# EAGLE design TireTempSensor (EAGLE 5.12)
BOARDNAME: Tire Thermal Sensor; BOM: EXCLUDE; DATABASE: ../../../../Component libraries/partsdb.txt; PARTNO: KC5032A25.0000CM0E00; RELEASE: BETA

## Sheet 1 of 6
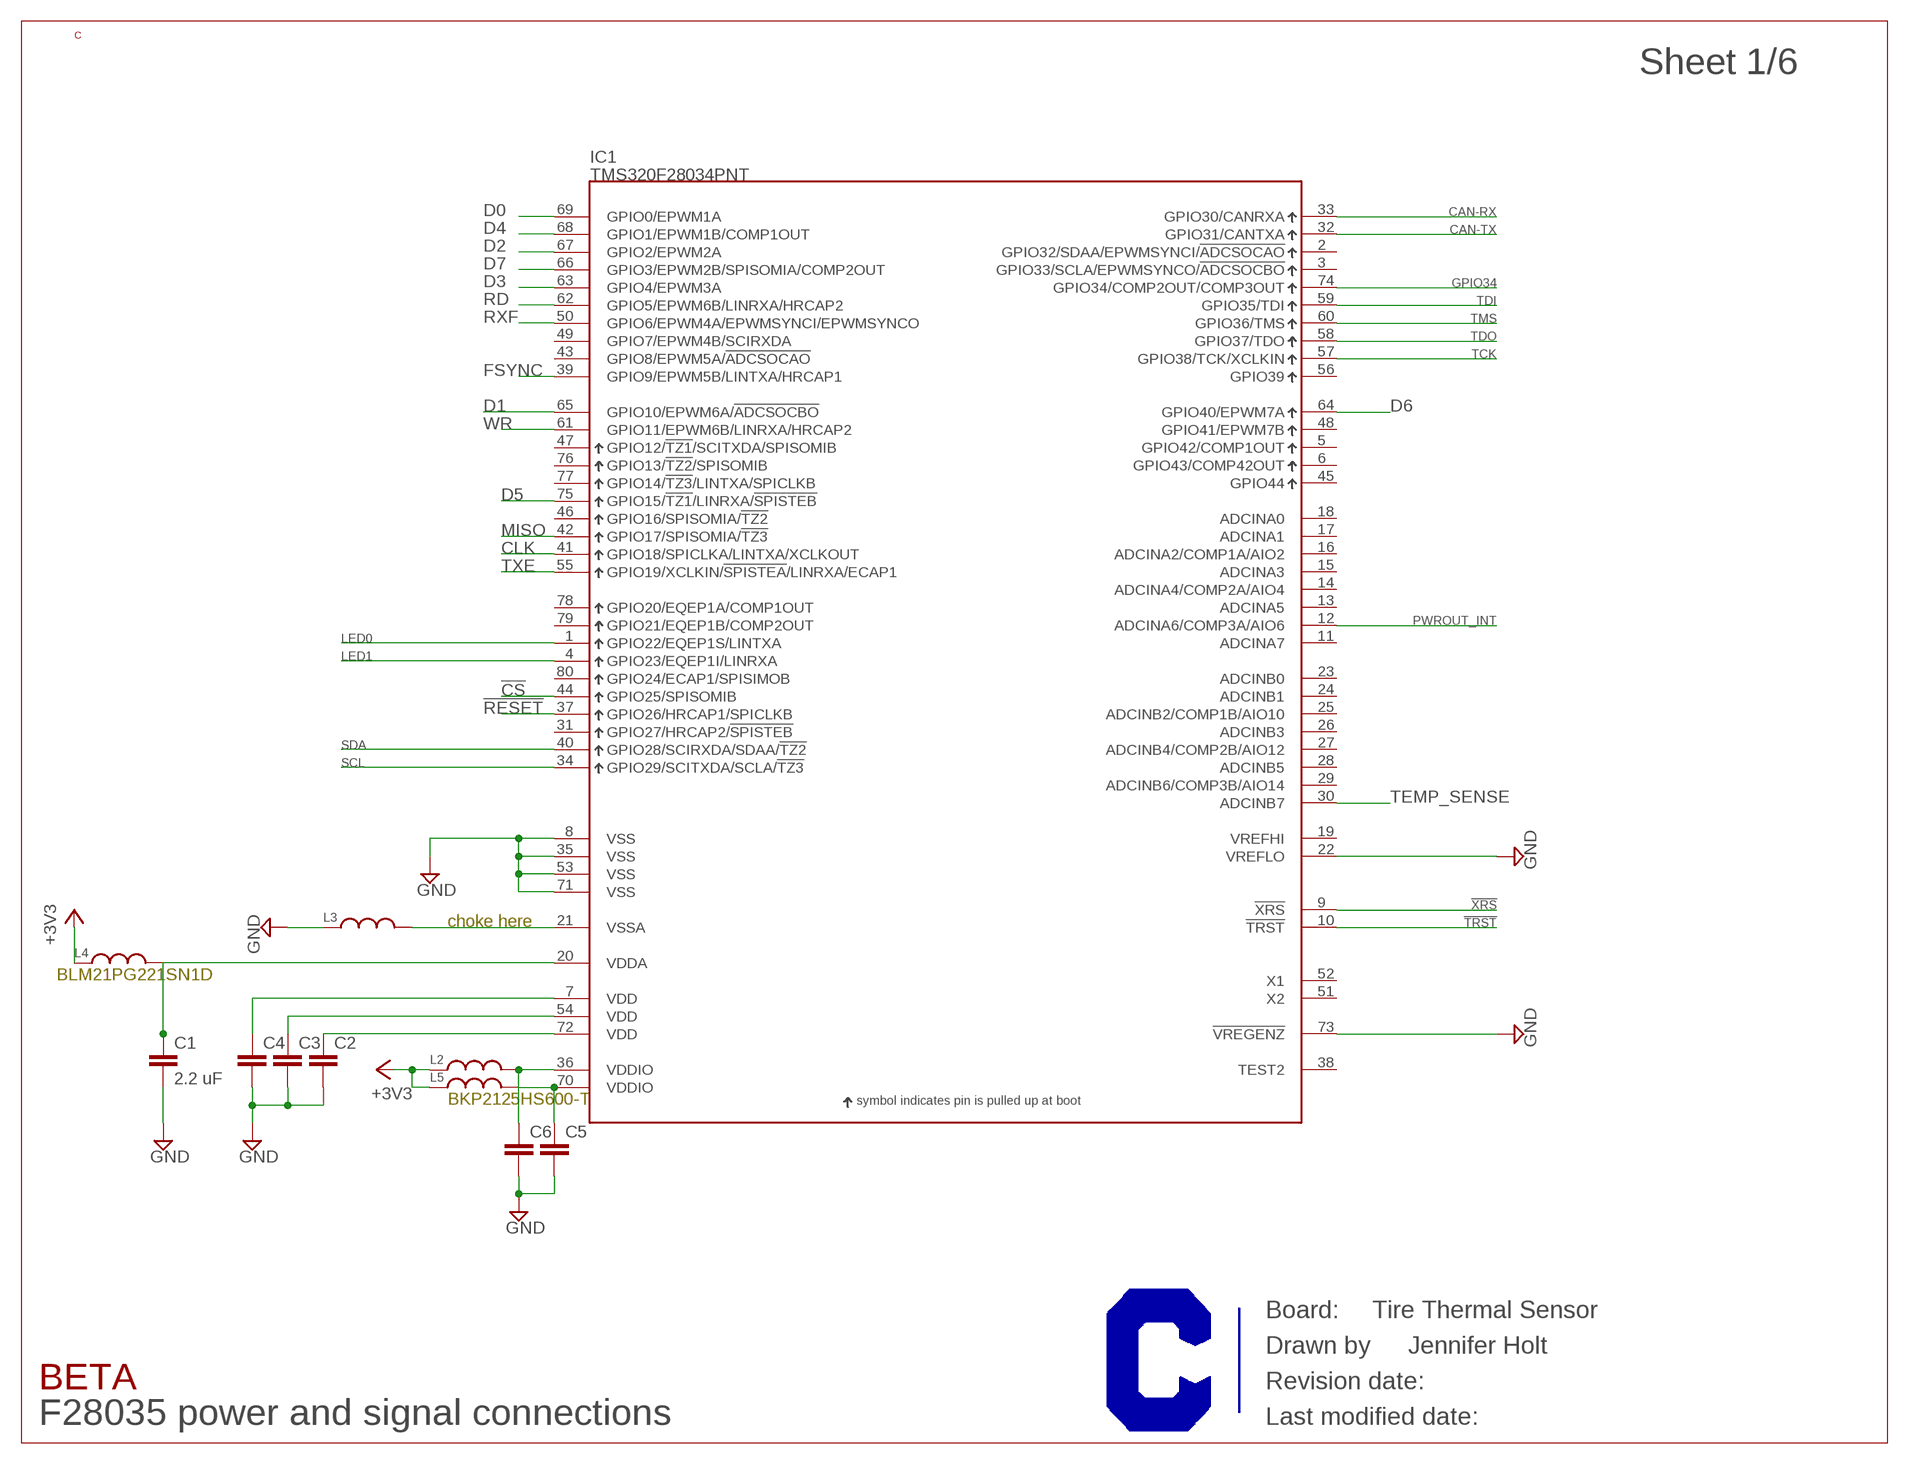
[diagram p0: schematic, sheet 1]

### Parts
C1  2.2 uF  C-EUC0603  [C0603]
C2  2.2 uF  C-EUC0603  [C0603]
C3  2.2 uF  C-EUC0603  [C0603]
C4  2.2 uF  C-EUC0603  [C0603]
C5  2.2 uF  C-EUC0603  [C0603]
C6  2.2 uF  C-EUC0603  [C0603]
IC1  TMS320F28034PNT  [PQFP-80_(S-PQFP-G80)]
L2  INDUCTOR  [0603]
L3  INDUCTOR  [0603]
L4  INDUCTOR  [0603]
L5  INDUCTOR  [0603]
U$2  CURRENT-C-LETTER-LANDSCAPE  [BLANK]
U$11  CURRENT-LOGO-0.25"  [CURRENT-0.25"]

### Nets
!CS: IC1.44(GPIO25/SPISOMIB) ; also sheet 6
!RESET: IC1.37(GPIO26/HRCAP1/SPICLKB) ; also sheet 6
!TRST: IC1.10(!TRST) ; also sheet 2
!XRS: IC1.9(!XRS)
+3V3 [power]: L2.A L4.A L5.A ; also sheet 2,3,5,6
CAN-RX: IC1.33(GPIO30/CANRXA) ; also sheet 4
CAN-TX: IC1.32(GPIO31/CANTXA) ; also sheet 4
CLK: IC1.41(GPIO18/SPICLKA/LINTXA/XCLKOUT) ; also sheet 6
D0: IC1.69(GPIO0/EPWM1A) ; also sheet 2
D1: IC1.65(GPIO10/EPWM6A/!ADCSOCBO) ; also sheet 2
D2: IC1.67(GPIO2/EPWM2A) ; also sheet 2
D3: IC1.63(GPIO4/EPWM3A) ; also sheet 2
D4: IC1.68(GPIO1/EPWM1B/COMP1OUT) ; also sheet 2
D5: IC1.75(GPIO15/!TZ1!/LINRXA/!SPISTEB) ; also sheet 2
D6: IC1.64(GPIO40/EPWM7A) ; also sheet 2
D7: IC1.66(GPIO3/EPWM2B/SPISOMIA/COMP2OUT) ; also sheet 2
FSYNC: IC1.39(GPIO9/EPWM5B/LINTXA/HRCAP1) ; also sheet 6
GND: C1.2 C2.2 C3.2 C4.2 C5.2 C6.2 IC1.8(VSS) IC1.22(VREFLO) IC1.35(VSS) IC1.53(VSS) IC1.71(VSS) IC1.73(!VREGENZ) L3.A ; also sheet 2,3,4,5,6
GPIO34: IC1.74(GPIO34/COMP2OUT/COMP3OUT) ; also sheet 2
LED0: IC1.1(GPIO22/EQEP1S/LINTXA) ; also sheet 5
LED1: IC1.4(GPIO23/EQEP1I/LINRXA) ; also sheet 5
MISO: IC1.42(GPIO17/SPISOMIA/!TZ3) ; also sheet 6
N$10: IC1.21(VSSA) L3.B
N$11: C6.1 IC1.36(VDDIO) L2.B
N$12: C5.1 IC1.70(VDDIO) L5.B
PWROUT_INT: IC1.12(ADCINA6/COMP3A/AIO6) ; also sheet 3
RD: IC1.62(GPIO5/EPWM6B/LINRXA/HRCAP2) ; also sheet 2
RXF: IC1.50(GPIO6/EPWM4A/EPWMSYNCI/EPWMSYNCO) ; also sheet 2
SCL: IC1.34(GPIO29/SCITXDA/SCLA/!TZ3) ; also sheet 6
SDA: IC1.40(GPIO28/SCIRXDA/SDAA/!TZ2) ; also sheet 6
TCK: IC1.57(GPIO38/TCK/XCLKIN) ; also sheet 2
TDI: IC1.59(GPIO35/TDI) ; also sheet 2
TDO: IC1.58(GPIO37/TDO) ; also sheet 2
TEMP_SENSE: IC1.30(ADCINB7) ; also sheet 6
TMS: IC1.60(GPIO36/TMS) ; also sheet 2
TXE: IC1.55(GPIO19/XCLKIN/!SPISTEA!/LINRXA/ECAP1) ; also sheet 2
VDD1: C2.1 IC1.72(VDD)
VDD2: C3.1 IC1.54(VDD)
VDD3: C4.1 IC1.7(VDD)
VDDA: C1.1 IC1.20(VDDA) L4.B
WR: IC1.61(GPIO11/EPWM6B/LINRXA/HRCAP2) ; also sheet 2
Unconnected: IC1.2(GPIO32/SDAA/EPWMSYNCI/!ADCSOCAO) IC1.3(GPIO33/SCLA/EPWMSYNCO/!ADCSOCBO) IC1.5(GPIO42/COMP1OUT) IC1.6(GPIO43/COMP42OUT) IC1.11(ADCINA7) IC1.13(ADCINA5) IC1.14(ADCINA4/COMP2A/AIO4) IC1.15(ADCINA3) IC1.16(ADCINA2/COMP1A/AIO2) IC1.17(ADCINA1) IC1.18(ADCINA0) IC1.19(VREFHI) IC1.23(ADCINB0) IC1.24(ADCINB1) IC1.25(ADCINB2/COMP1B/AIO10) IC1.26(ADCINB3) IC1.27(ADCINB4/COMP2B/AIO12) IC1.28(ADCINB5) IC1.29(ADCINB6/COMP3B/AIO14) IC1.31(GPIO27/HRCAP2/!SPISTEB) IC1.38(TEST2) IC1.43(GPIO8/EPWM5A/!ADCSOCAO) IC1.45(GPIO44) IC1.46(GPIO16/SPISOMIA/!TZ2) IC1.47(GPIO12/!TZ1!/SCITXDA/SPISOMIB) IC1.48(GPIO41/EPWM7B) IC1.49(GPIO7/EPWM4B/SCIRXDA) IC1.51(X2) IC1.52(X1) IC1.56(GPIO39) IC1.76(GPIO13/!TZ2!/SPISOMIB) IC1.77(GPIO14/!TZ3!/LINTXA/SPICLKB) IC1.78(GPIO20/EQEP1A/COMP1OUT) IC1.79(GPIO21/EQEP1B/COMP2OUT) IC1.80(GPIO24/ECAP1/SPISIMOB)

### Notes on the sheet
- choke here
- BLM21PG221SN1D
- BKP2125HS600-T
- Jennifer Holt
- F28035 power and signal connections

## Sheet 2 of 6
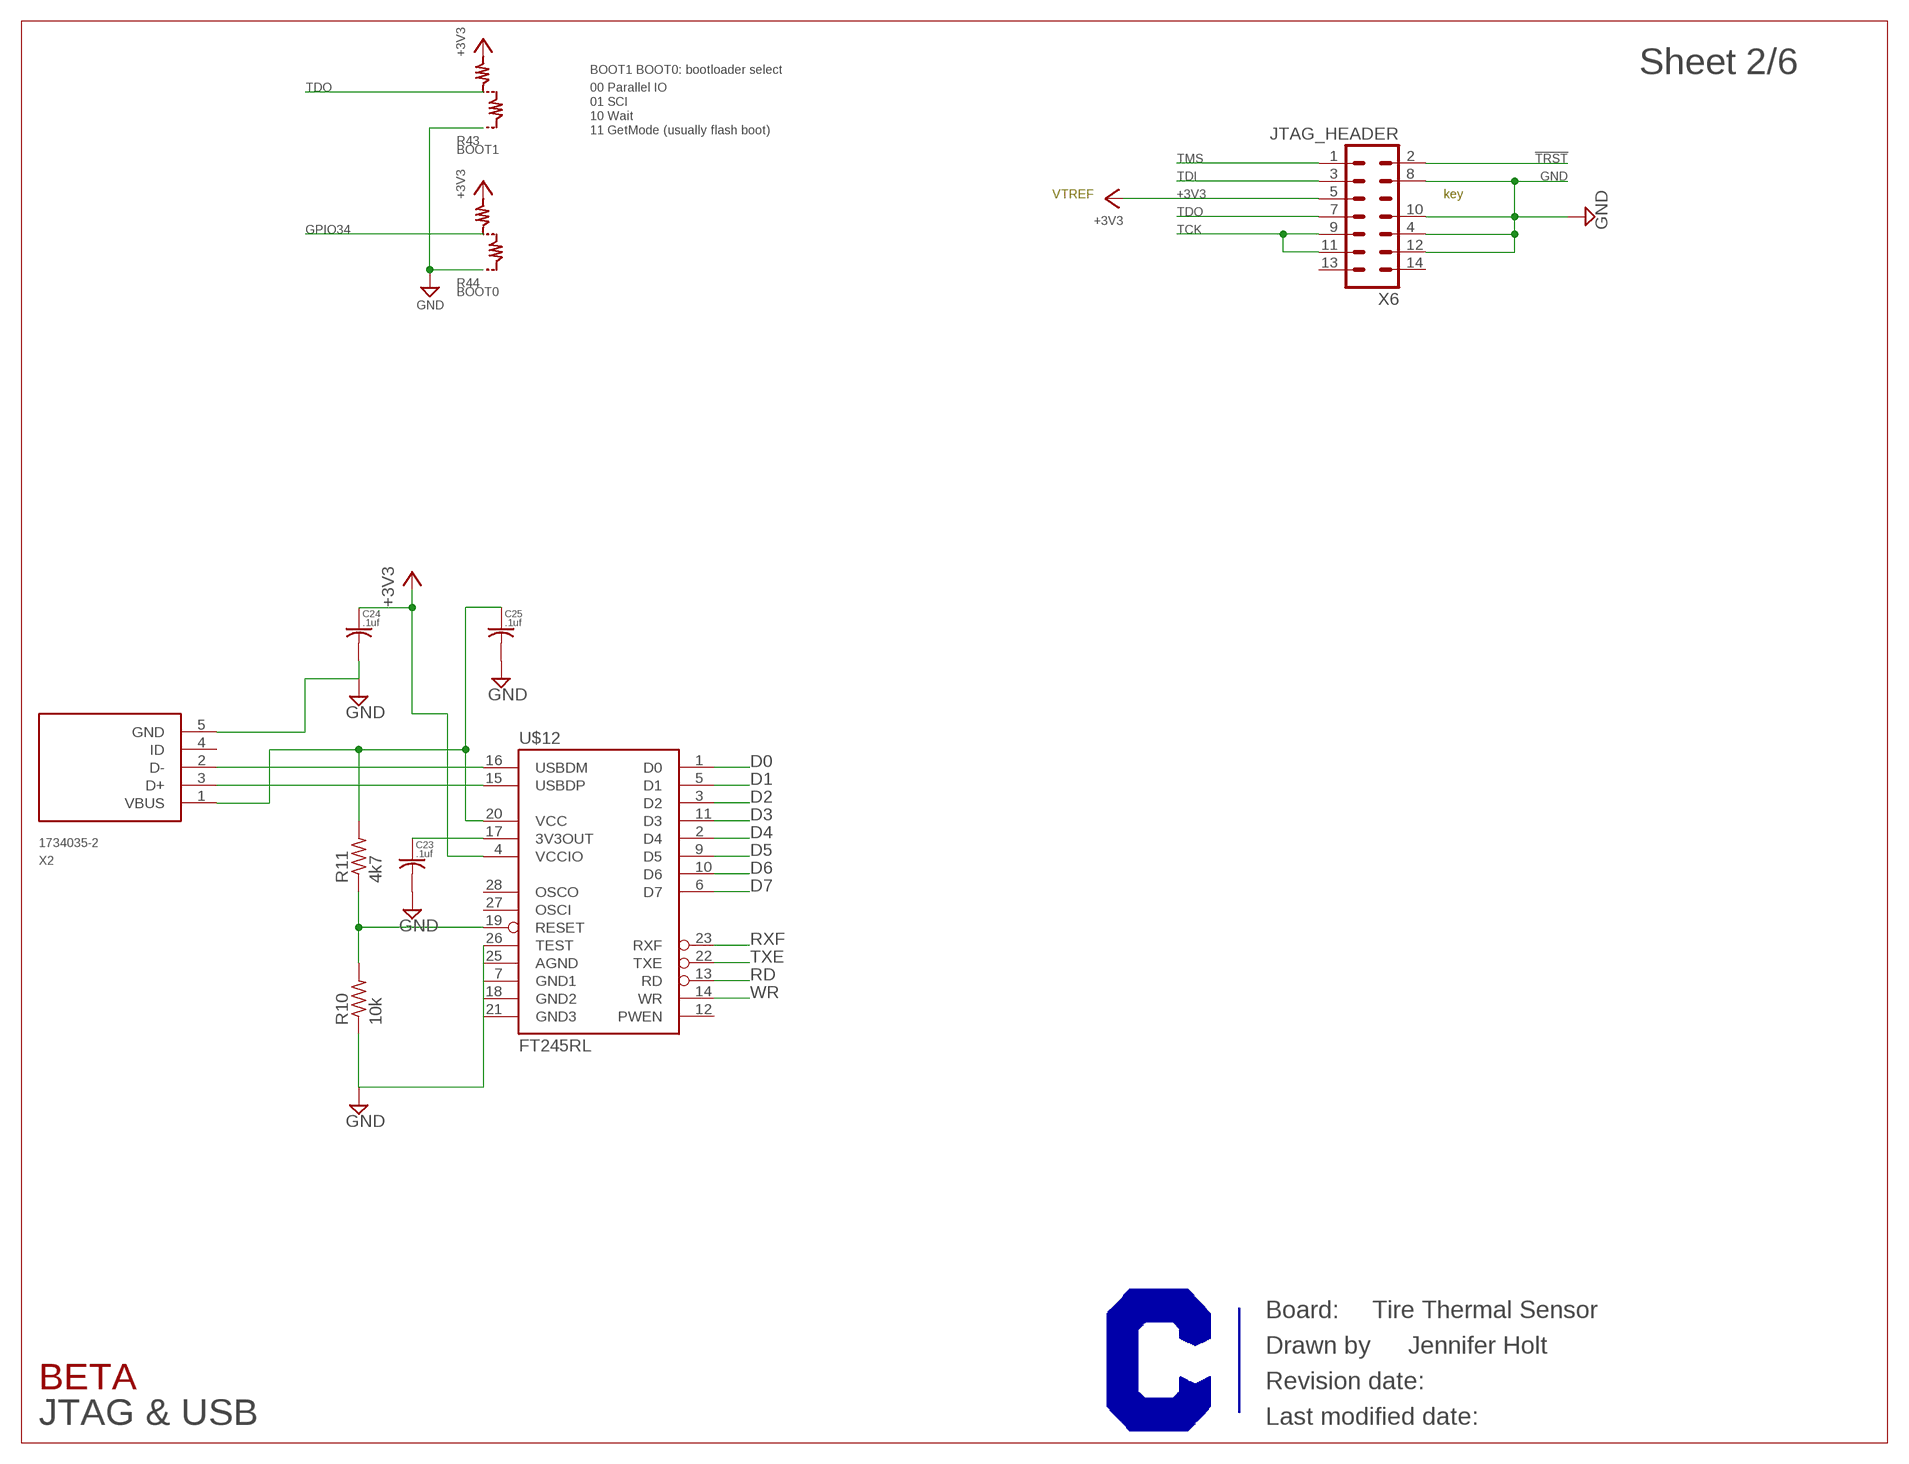
[diagram p1: schematic, sheet 2]

### Parts
C23  .1uf  C-USC0603  [C0603]
C24  .1uf  C-USC0603  [C0603]
C25  .1uf  C-USC0603  [C0603]
R10  10k  R-US_R0603  [R0603]
R11  4k7  R-US_R0603  [R0603]
R43  BOOT1  0402-JUMPER-3WAY-0603  [0603-JUMPER-3WAY]
R44  BOOT0  0402-JUMPER-3WAY-0603  [0603-JUMPER-3WAY]
U$3  CURRENT-C-LETTER-LANDSCAPE  [BLANK]
U$12  FT245RL  [SSOP28DB]
X2  1734035-2  [1734035-2]
X6  JTAG_HEADER  JTAG_HEADER-0.05"-SMT-VERT  [TI_JTAG_HEADER_0.05"_SMT]

### Nets
!TRST: X6.2(!TRST) ; also sheet 1
+3V3 [power]: C24.1 R43.B R44.B U$12.4(VCCIO) X6.5(VTREF) ; also sheet 1,3,5,6
D0: U$12.1(D0) ; also sheet 1
D1: U$12.5(D1) ; also sheet 1
D2: U$12.3(D2) ; also sheet 1
D3: U$12.11(D3) ; also sheet 1
D4: U$12.2(D4) ; also sheet 1
D5: U$12.9(D5) ; also sheet 1
D6: U$12.10(D6) ; also sheet 1
D7: U$12.6(D7) ; also sheet 1
GND: C23.2 C24.2 C25.2 R10.1 R43.C R44.C U$12.7(GND1) U$12.18(GND2) U$12.21(GND3) U$12.25(AGND) U$12.26(TEST) X2.5(GND) X6.4(GND) X6.8(GND) X6.10(GND) X6.12(GND) ; also sheet 1,3,4,5,6
GPIO34: R44.A ; also sheet 1
N$5: C25.1 R11.2 U$12.20(VCC) X2.1(VBUS)
N$6: R10.2 R11.1 U$12.19(RESET)
N$25: U$12.15(USBDP) X2.3(D+)
N$27: U$12.16(USBDM) X2.2(D-)
N$30: C23.1 U$12.17(3V3OUT)
RD: U$12.13(RD) ; also sheet 1
RXF: U$12.23(RXF) ; also sheet 1
TCK: X6.9(TCK) X6.11 ; also sheet 1
TDI: X6.3(TDI) ; also sheet 1
TDO: R43.A X6.7(TDO) ; also sheet 1
TMS: X6.1(TMS) ; also sheet 1
TXE: U$12.22(TXE) ; also sheet 1
WR: U$12.14(WR) ; also sheet 1
Unconnected: U$12.12(PWEN) U$12.27(OSCI) U$12.28(OSCO) X2.4(ID) X6.13(EMU0) X6.14(EMU1)

### Notes on the sheet
- BOOT1 BOOT0: bootloader select
- 00 Parallel IO
- 01 SCI
- 10 Wait
- 11 GetMode (usually flash boot)
- VTREF | key
- Jennifer Holt
- JTAG & USB

## Sheet 3 of 6
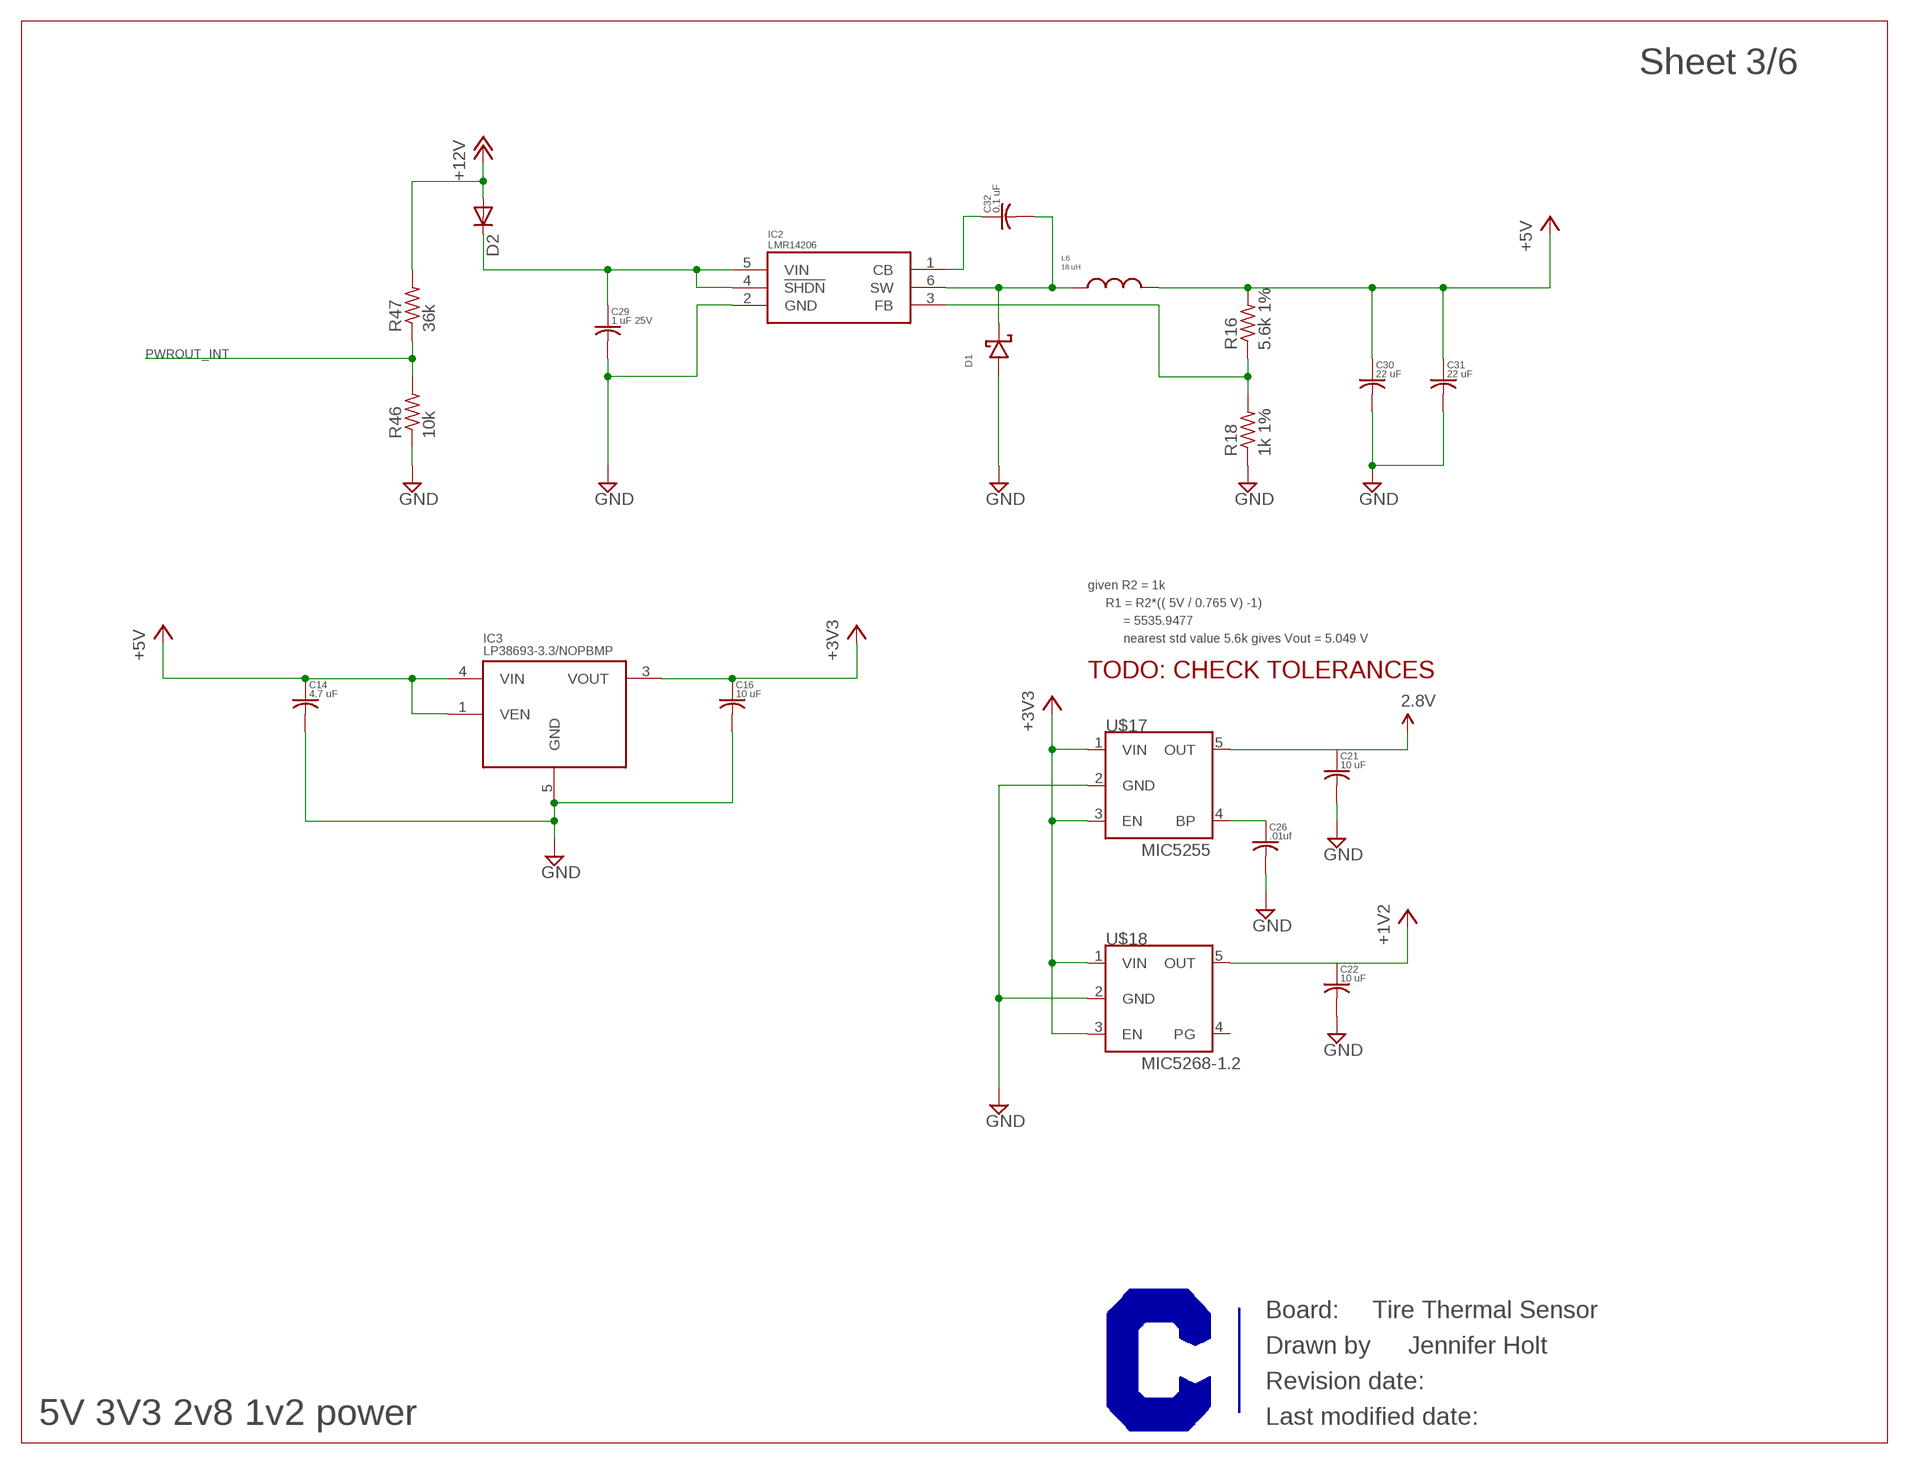
[diagram p2: schematic, sheet 3]

### Parts
C14  4.7 uF  C-USC0805  [C0805]
C16  10 uF  C-USC0603  [C0603]
C21  10 uF  C-USC0603  [C0603]
C22  10 uF  C-USC0603  [C0603]
C26  .01uf  C-USC0603  [C0603]
C29  1 uF 25V  C-USC1206  [C1206]
C30  22 uF  C-USC0805  [C0805]
C31  22 uF  C-USC0805  [C0805]
C32  0.1 uF  C-USC0603  [C0603]
D1  SCHOTTKY_DIODE-SMA  [SMA]
D2  DIODE-SOD123  [SOD123]
IC2  LMR14206  [SOT-6_DDC]
IC3  LP38693-3.3/NOPBMP  [SOT-223-5]
L6  18 uH  VLP8040T  [VLP8040]
R16  5.6k 1%  R-US_R0603  [R0603]
R18  1k 1%  R-US_R0603  [R0603]
R46  10k  R-US_R0603  [R0603]
R47  36k  R-US_R0603  [R0603]
U$6  CURRENT-C-LETTER-LANDSCAPE  [BLANK]
U$17  MIC5255  [SOT23-5]
U$18  MIC5268-1.2  [SOT23-5]

### Nets
2.8V [power]: C21.1 U$17.5(OUT) ; also sheet 6
+1V2 [power]: C22.1 U$18.5(OUT) ; also sheet 6
+3V3 [power]: C16.1 IC3.3(VOUT) U$17.1(VIN) U$17.3(EN) U$18.1(VIN) U$18.3(EN) ; also sheet 1,2,5,6
+5V: C14.1 C30.1 C31.1 IC3.1(VEN) IC3.4(VIN) L6.2 R16.2 ; also sheet 4,6
+12V: D2.A R47.2 ; also sheet 4,5
GND: C14.2 C16.2 C21.2 C22.2 C26.2 C29.2 C30.2 C31.2 D1.ANODE IC2.2(GND) IC3.5(GND) R18.1 R46.1 U$17.2(GND) U$18.2(GND) ; also sheet 1,2,4,5,6
N$3: C32.2 D1.CATHODE IC2.6(SW) L6.1
N$7: C32.1 IC2.1(CB)
N$8: C29.1 D2.C IC2.4(!SHDN) IC2.5(VIN)
N$31: C26.1 U$17.4(BP)
PWROUT_INT: R46.2 R47.1 ; also sheet 1
VSENSE1: IC2.3(FB) R16.1 R18.2
Unconnected: U$18.4(PG)

### Notes on the sheet
- given R2 = 1k
- R1 = R2*(( 5V / 0.765 V) -1)
- = 5535.9477
- nearest std value 5.6k gives Vout = 5.049 V
- TODO: CHECK TOLERANCES
- Jennifer Holt
- 5V 3V3 2v8 1v2 power

## Sheet 4 of 6
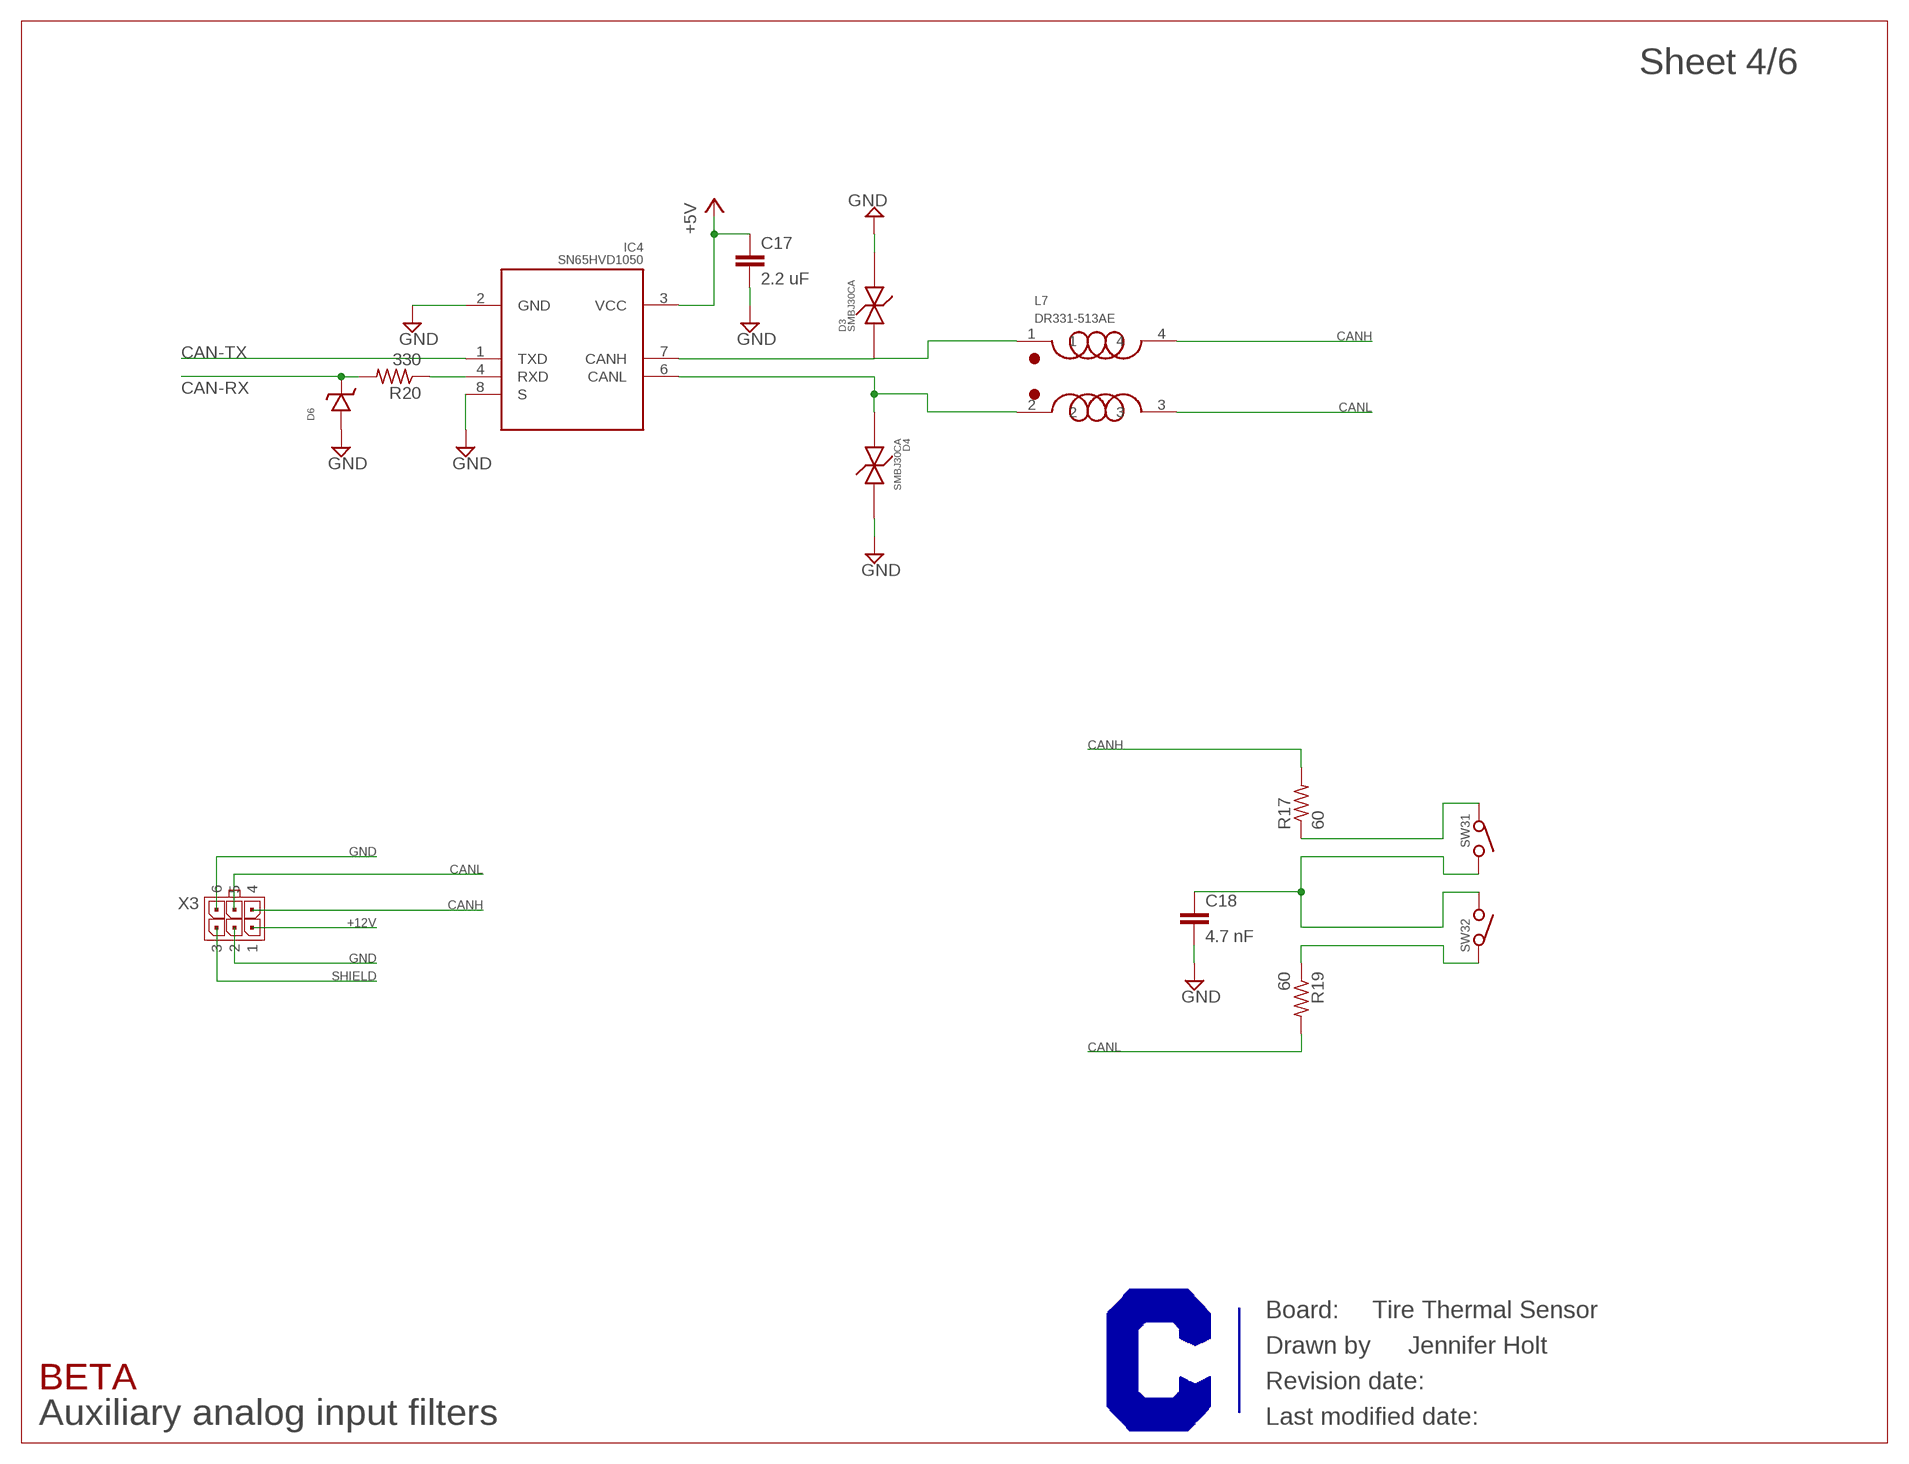
[diagram p3: schematic, sheet 4]

### Parts
C17  2.2 uF  C-EUC0603  [C0603]
C18  4.7 nF  C-EUC0603  [C0603]
D3  SMBJ30CA  [DO-214AA]
D4  SMBJ30CA  [DO-214AA]
D6  ZENER_DIODE-SOD-323  [SOD-323]
IC4  SN65HVD1050  [D_(R-PDSO-G8)]
L7  DR331-513AE  [SMD]
R17  60  R-US_R0603  [R0603]
R19  60  R-US_R0603  [R0603]
R20  330  R-US_R0603  [R0603]
SW3  218-2_GULLWING  [218-2_GULLWING]
U$9  CURRENT-C-LETTER-LANDSCAPE  [BLANK]
X3  MICROFIT-06-DUAL-RA-SMD  [MICROFIT-6-DUAL-RA-SMD]

### Nets
+5V: C17.1 IC4.3(VCC) ; also sheet 3,6
+12V: X3.1 ; also sheet 3,5
CAN-RX: D6.CATHODE R20.2 ; also sheet 1
CAN-TX: IC4.1(TXD) ; also sheet 1
CANH: L7.4 R17.2 X3.4
CANL: L7.3 R19.2 X3.5
GND: C17.2 C18.2 D3.2 D4.2 D6.ANODE IC4.2(GND) IC4.8(S) X3.2 X3.6 ; also sheet 1,2,3,5,6
N$20: D4.1 IC4.6(CANL) L7.2
N$21: D3.1 IC4.7(CANH) L7.1
N$22: R19.1 SW3.2A
N$23: R17.1 SW3.1A
N$24: C18.1 SW3.1B SW3.2B
N$32: IC4.4(RXD) R20.1
SHIELD: X3.3

### Notes on the sheet
- Jennifer Holt
- Auxiliary analog input filters

## Sheet 5 of 6
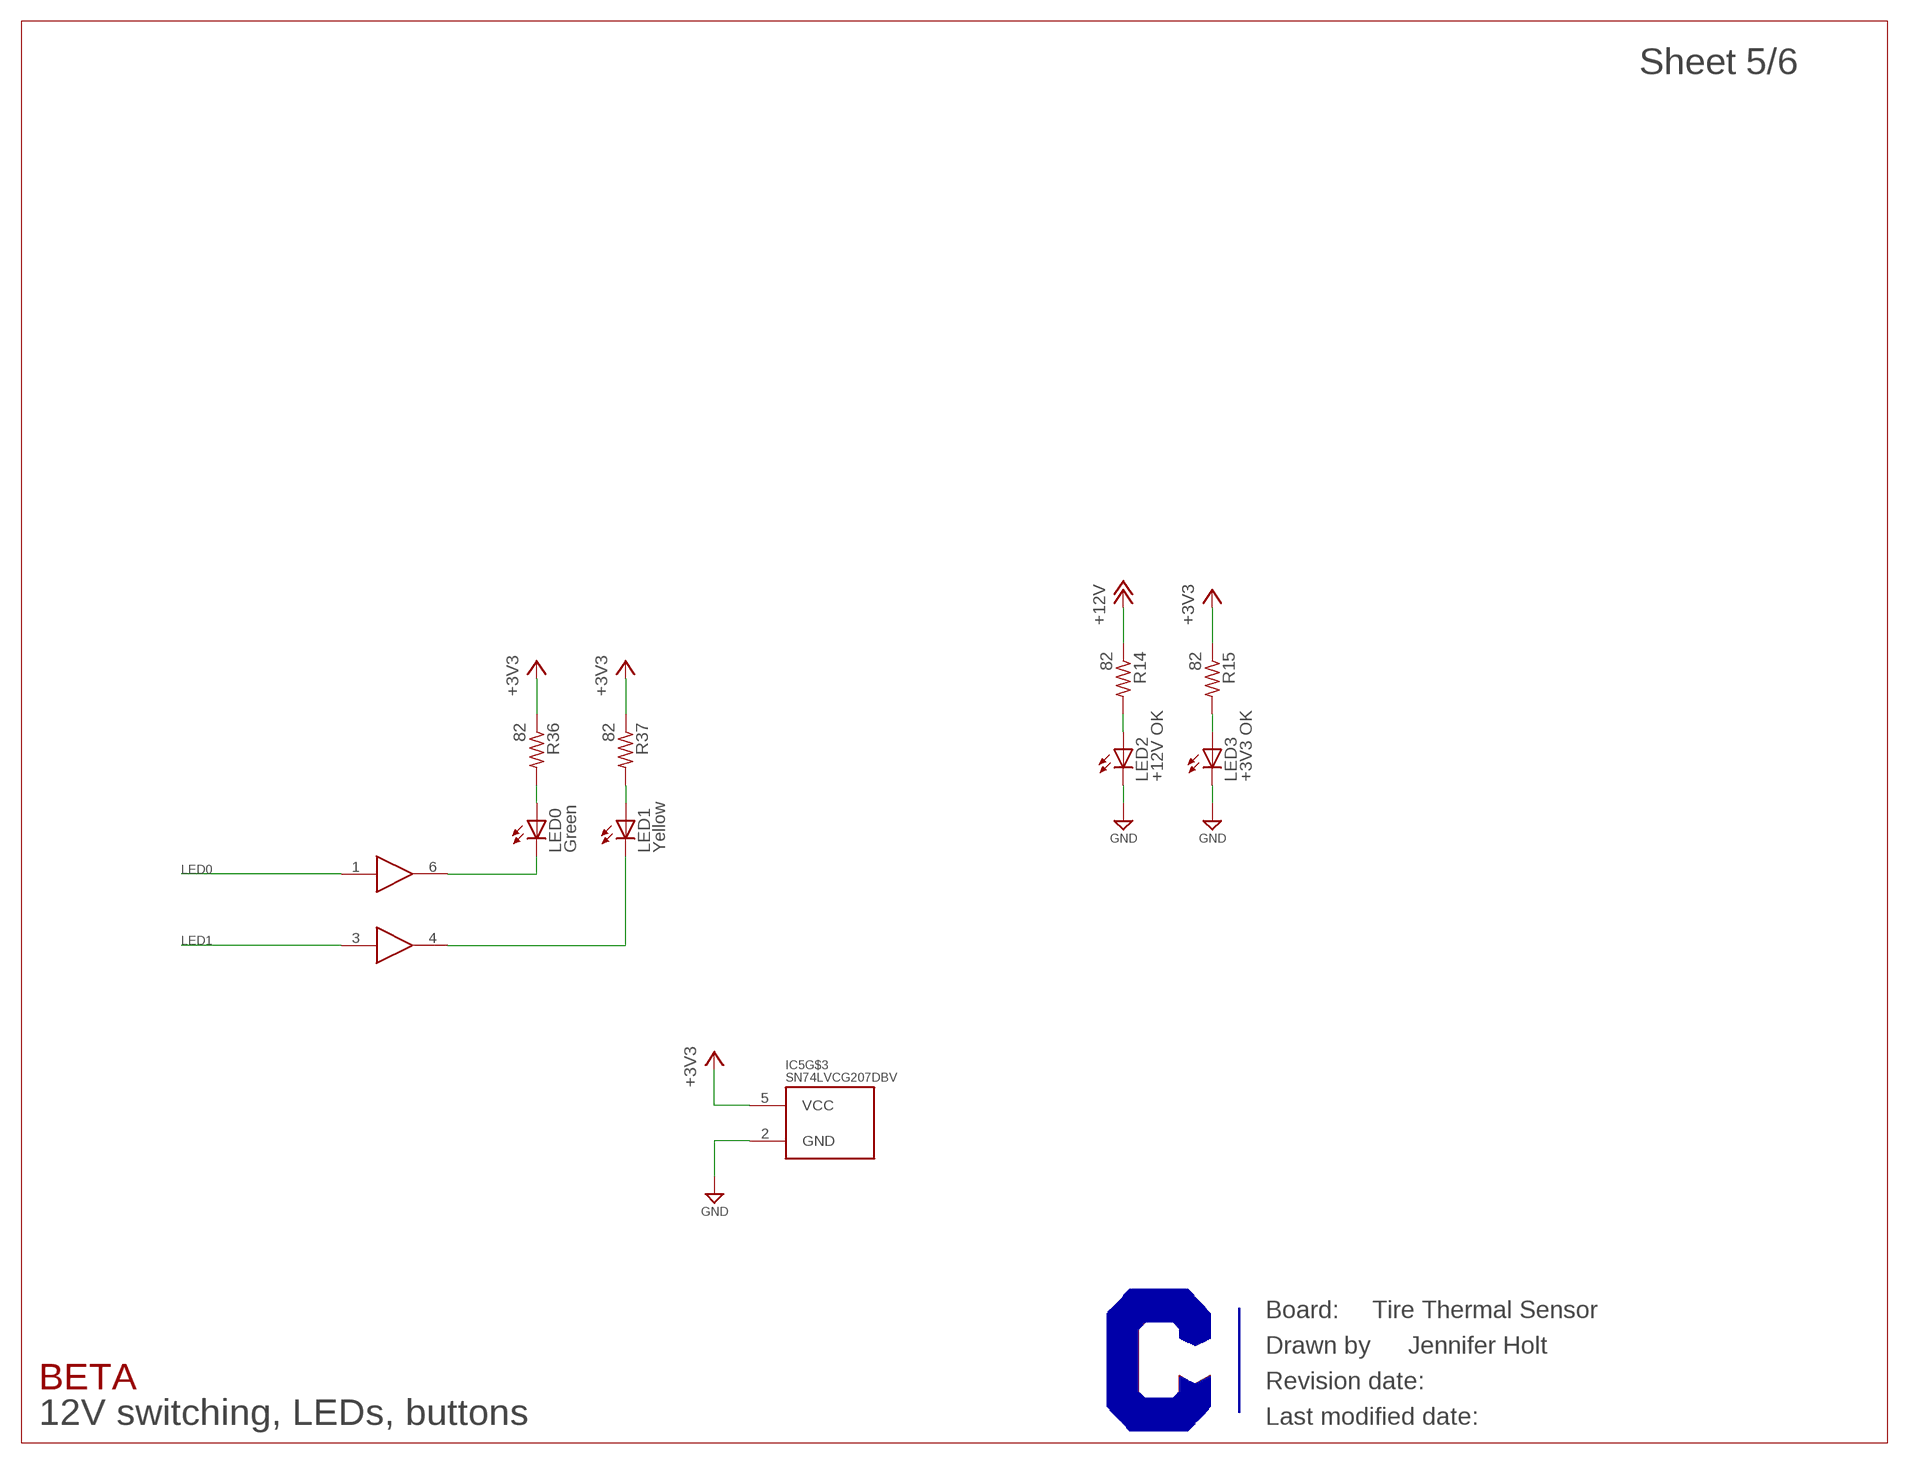
[diagram p4: schematic, sheet 5]

### Parts
IC5  SN74LVCG207DBV  [DBV_(R-PDSO-G6)]
LED0  Green  LEDCHIP-LED0603  [CHIP-LED0603]
LED1  Yellow  LEDCHIP-LED0603  [CHIP-LED0603]
LED2  +12V OK  LEDCHIP-LED0603  [CHIP-LED0603]
LED3  +3V3 OK  LEDCHIP-LED0603  [CHIP-LED0603]
R14  82  R-US_R0603  [R0603]
R15  82  R-US_R0603  [R0603]
R36  82  R-US_R0603  [R0603]
R37  82  R-US_R0603  [R0603]
U$1  CURRENT-C-LETTER-LANDSCAPE  [BLANK]

### Nets
+3V3 [power]: IC5.5(VCC) R15.1 R36.1 R37.1 ; also sheet 1,2,3,6
+12V: R14.1 ; also sheet 3,4
GND: IC5.2(GND) LED2.C LED3.C ; also sheet 1,2,3,4,6
LED0: IC5.1(A) ; also sheet 1
LED1: IC5.3(A) ; also sheet 1
N$1: LED2.A R14.2
N$2: LED3.A R15.2
N$37: IC5.6(Y) LED0.C
N$38: IC5.4(Y) LED1.C
N$39: LED0.A R36.2
N$40: LED1.A R37.2

### Notes on the sheet
- Jennifer Holt
- 12V switching, LEDs, buttons

## Sheet 6 of 6
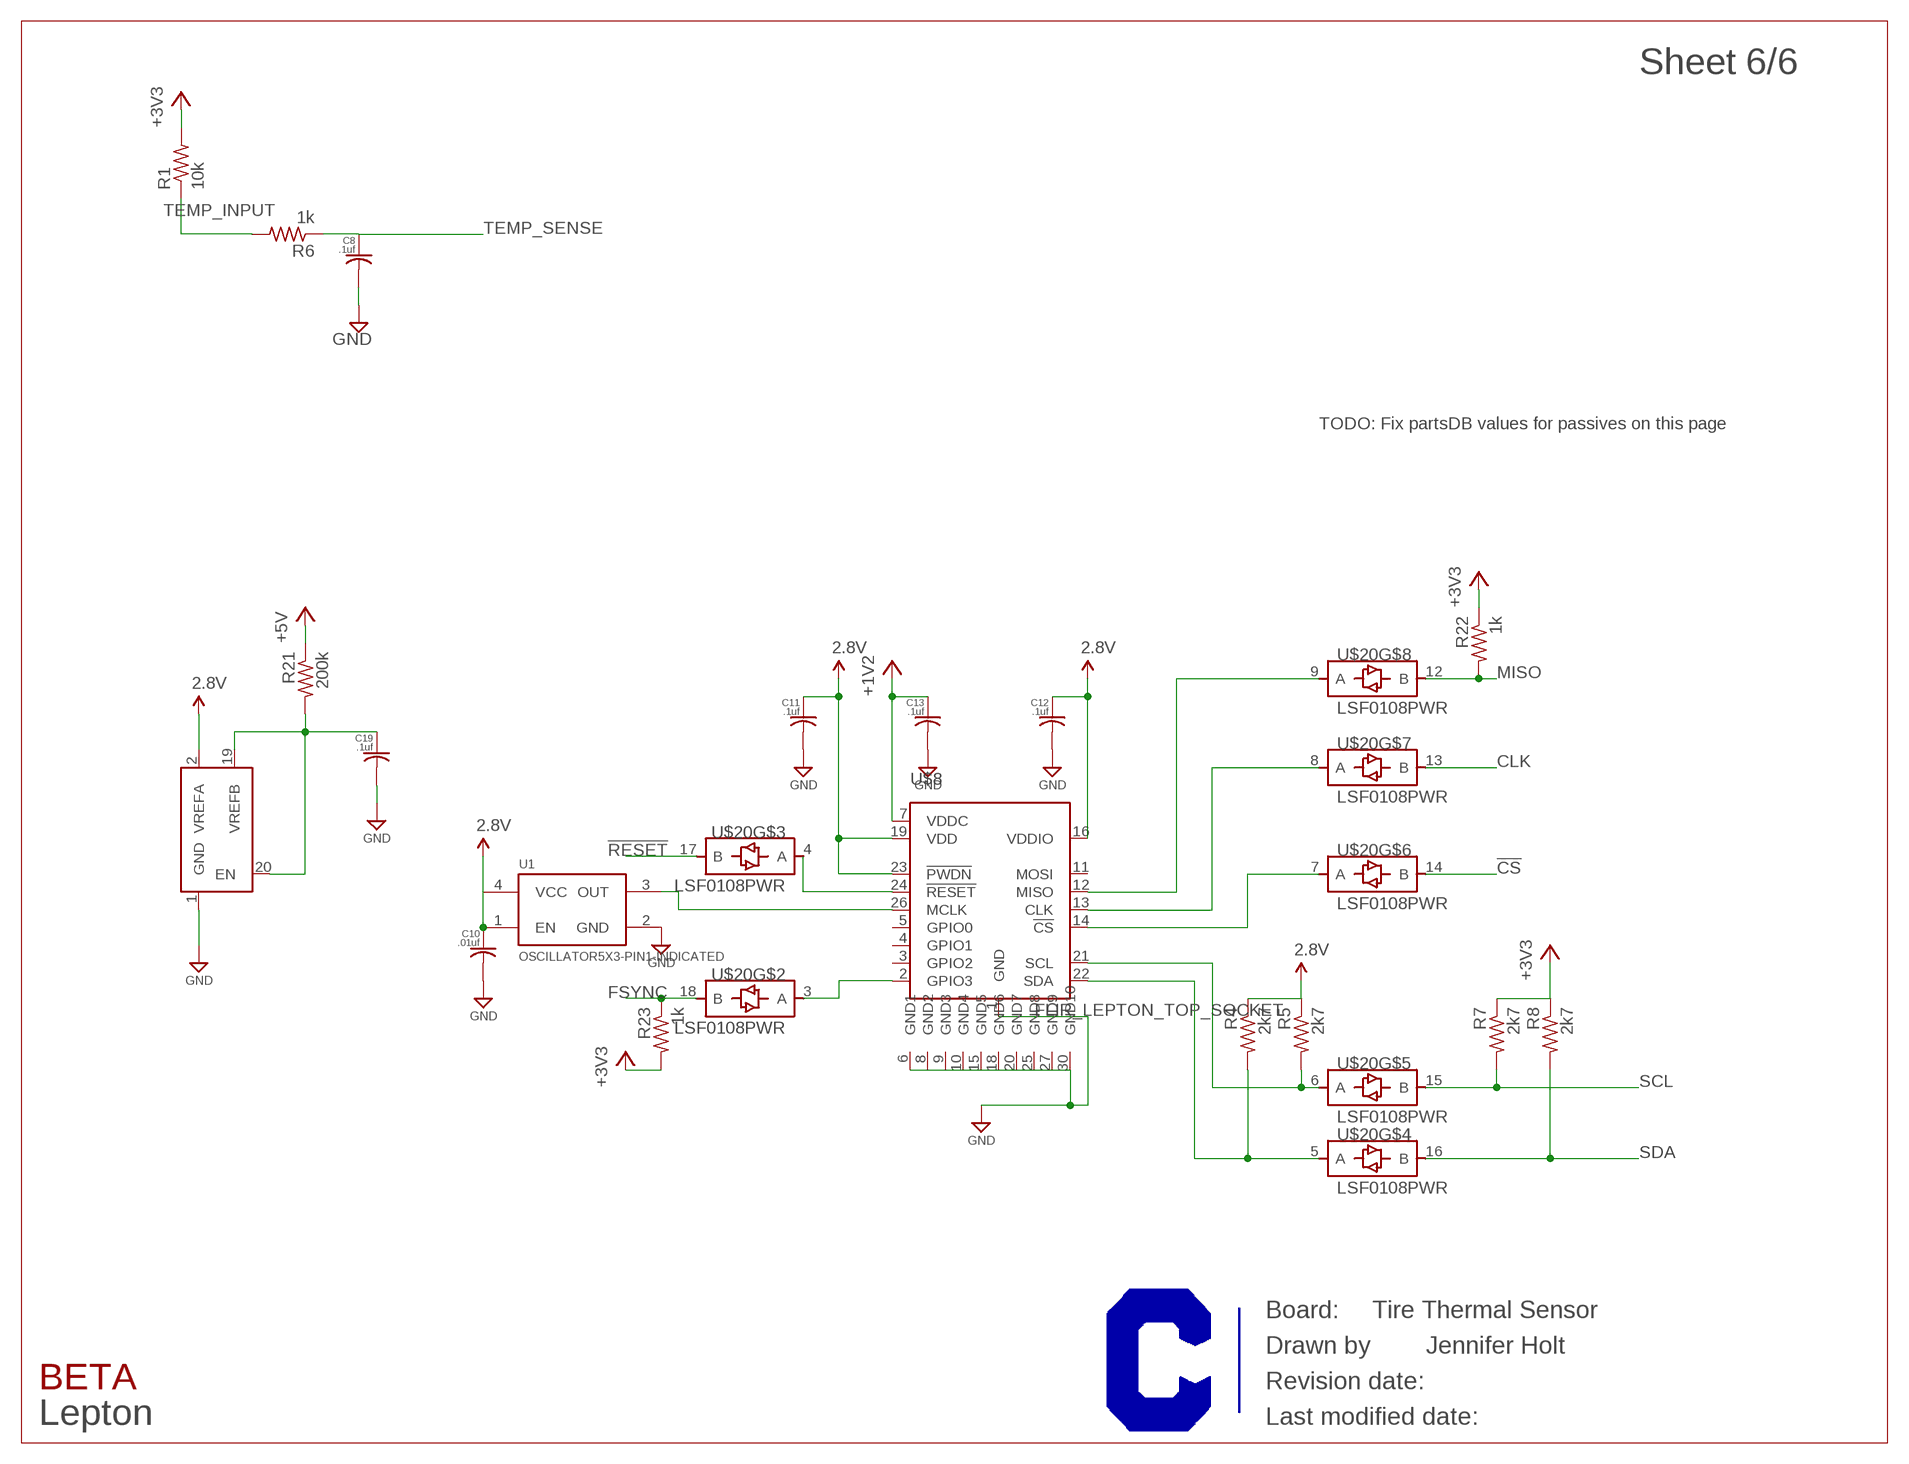
[diagram p5: schematic, sheet 6]

### Parts
C8  .1uf  C-USC0603  [C0603]
C10  .01uf  C-USC0603  [C0603]
C11  .1uf  C-USC0603  [C0603]
C12  .1uf  C-USC0603  [C0603]
C13  .1uf  C-USC0603  [C0603]
C19  .1uf  C-USC0603  [C0603]
R1  10k  R-US_R0603  [R0603]
R4  2k7  R-US_R0603  [R0603]
R5  2k7  R-US_R0603  [R0603]
R6  1k  R-US_R0603  [R0603]
R7  2k7  R-US_R0603  [R0603]
R8  2k7  R-US_R0603  [R0603]
R21  200k  R-US_R0603  [R0603]
R22  1k  R-US_R0603  [R0603]
R23  1k  R-US_R0603  [R0603]
U1  OSCILLATOR5X3-PIN1-INDICATED  [CRYSTAL-OSC-SMD-5X3]
U$7  CURRENT-C-LETTER-LANDSCAPE  [BLANK]
U$8  FLIR_LEPTON_TOP_SOCKET  [105028-1001]
U$20  LSF0108PWR  [TSSOP20]

### Nets
2.8V [power]: C10.1 C11.1 C12.1 R4.1 R5.1 U1.1(EN) U1.4(VCC) U$8.16(VDDIO) U$8.19(VDD) U$8.23(!PWDN) U$20.2(VREFA) ; also sheet 3
!CS: U$20.14(B) ; also sheet 1
!CS!_A: U$8.14(!CS) U$20.7(A)
!RESET: U$20.17(B) ; also sheet 1
!RESET!_A: U$8.24(!RESET) U$20.4(A)
+1V2 [power]: C13.1 U$8.7(VDDC) ; also sheet 3
+3V3 [power]: R1.2 R7.1 R8.1 R22.1 R23.2 ; also sheet 1,2,3,5
+5V: R21.1 ; also sheet 3,4
CLK: U$20.13(B) ; also sheet 1
CLK_A: U$8.13(CLK) U$20.8(A)
FSYNC: R23.1 U$20.18(B) ; also sheet 1
FSYNC_A: U$8.2(GPIO3) U$20.3(A)
GND: C8.2 C10.2 C11.2 C12.2 C13.2 C19.2 U1.2(GND) U$8.1(GND) U$8.6(GND1) U$8.8(GND2) U$8.9(GND3) U$8.10(GND4) U$8.15(GND5) U$8.18(GND6) U$8.20(GND7) U$8.25(GND8) U$8.27(GND9) U$8.30(GND10) U$20.1(GND) ; also sheet 1,2,3,4,5
MCLK: U1.3(OUT) U$8.26(MCLK)
MISO: R22.2 U$20.12(B) ; also sheet 1
MISO_A: U$8.12(MISO) U$20.9(A)
N$4 [power]: C19.1 R21.2 U$20.19(VREFB) U$20.20(EN)
SCL: R7.2 U$20.15(B) ; also sheet 1
SCL_A: R5.2 U$8.21(SCL) U$20.6(A)
SDA: R8.2 U$20.16(B) ; also sheet 1
SDA_A: R4.2 U$8.22(SDA) U$20.5(A)
TEMP_INPUT: R1.1 R6.2
TEMP_SENSE: C8.1 R6.1 ; also sheet 1
Unconnected: U$8.3(GPIO2) U$8.4(GPIO1) U$8.5(GPIO0) U$8.11(MOSI) U$8.28(MIPI_CLK_N) U$8.29(MIPI_CLK_P) U$8.31(MIPI_DATA_N) U$8.32(MIPI_DATA_P) U$20.10(A) U$20.11(B)

### Notes on the sheet
- TODO: Fix partsDB values for passives on this page
- Jennifer Holt
- Lepton

## Power pins joined to a net without a drawn wire
GND: U$8.M1(GND) U$8.M2(GND) U$8.M3(GND) U$8.M4(GND) U$8.M5(GND) U$8.M6(GND) U$8.M7(GND) U$8.M8(GND) U$8.M9(GND) U$8.M10(GND) U$8.M11(GND) U$8.M12(GND) U$8.M13(GND) U$8.M14(GND) U$8.M15(GND) U$8.M16(GND) U$8.M17(GND) U$8.M18(GND) U$8.M19(GND) U$8.M20(GND) U$8.M21(GND) U$8.M22(GND) U$8.M23(GND) U$8.M24(GND) U$8.M25(GND) U$8.M26(GND) U$8.M27(GND) U$8.M28(GND) U$8.M29(GND) U$8.M30(GND) U$8.M31(GND) U$8.M32(GND) U$8.M33(GND) U$8.M34(GND) U$8.M35(GND) U$8.M36(GND)

## Library data of the parts
C1-C6 C17 C18 = rcl:C-EU: CAPACITOR, European symbol
C8 C10-C14 C16 C19 C21-C26 C29-C32 = rcl:C-US: CAPACITOR, American symbol
D1 = Diodes:SCHOTTKY_DIODE
D2 = diode:DIODE-: DIODE
D3 D4 = Littelfuse:SMBJ30CA: Bidirectional TVS Zener Diode 30V Breakdown http://www.digikey.com/product-detail/en/SMBJ30CA/SMBJ30CALFCT-ND/286112; PARTNO: SMBJ30CALFCT-ND
D6 = Diodes:ZENER_DIODE
IC1 = TI:TMS320F28034: TMS320F2803x (Piccolo) 32-Bit High-Efficiency MCU Datasheet: http://www.ti.com/lit/ds/sprs584j/sprs584j.pdf Product page: http://www.ti.com/product/tms320f28034; PARTNO: TMS320F28035PNT
IC2 = TI:LMR14206: LMR14206 SIMPLE SWITCHER® 42Vin, 0.6A Step-Down Voltage Regulator in SOT-23 Datasheet: http://www.ti.com/lit/ds/symlink/lmr14206.pdf
IC3 = TI:LP38693: TI LP38693-3.3 LDO 500mA Very Low Vdo. http://www.ti.com/lit/ds/symlink/lp38693.pdf; PARTNO: LP38693MP-3.3/NOPB
IC4 = TI:SN65HVD1050: SN65HVD1050 - EMC Optimized CAN Transceiever Datasheet: http://www.ti.com/lit/ds/symlink/sn65hvd1050.pdf; PARTNO: SN65HVD1050D
IC5 = TI:SN74LVCG207: SN74LVC2G07: Dual Buffer/Driver with Open Drain Outputs no datasheet 4 u!!
L2-L5 = Passives:INDUCTOR
L6 = TDK:VLP: VLP Series Shielded Wound Ferrite Inductors Datasheet: http://datasheet.octopart.com/VLP8040T-100M-TDK-datasheet-16646286.pdf
L7 = Bourns:DR331-513AE: Bourns Common Mode Choke; PARTNO: DR331-513AECT-ND
LED0 LED1-LED3 = led:LED: LED OSRAM: - CHIPLED LG R971, LG N971, LY N971, LG Q971, LY Q971, LO R971, LY R971 LH N974, LH R974 LS Q976, LO Q976, LY Q976 LO Q996 - Hyper CHIPLED LW Q18S LB Q993, LB Q99A, LB R99A - SideLED LS A670, LO A670, LY A670, LG A670, LP A670 LB A673, LV A673, LT A673, LW A673 LH A674 LY A675 LS A676, LA A676, LO A676, LY A676, LW A676 LS A679, LY A679, LG A679 - Hyper Micro SIDELED® LS Y876, LA Y876, LO Y876, LY Y876 LT Y87S - SmartLED LW L88C, LW L88S LB L89C, LB L89S, LG L890 LS L89K, LO L89K, LY L89K LS L896, LA L896, LO L896, LY L896 - TOPLED LS T670, LO T670, LY T670, LG T670, LP T670 LSG T670, LSP T670, LSY T670, LOP T670, LYG T670 LG T671, LOG T671, LSG T671 LB T673, LV T673, LT T673, LW T673 LH T674 LS T676, LA T676, LO T676, LY T676, LB T676, LH T676, LSB T676, LW T676 LB T67C, LV T67C, LT T67C, LS T67K, LO T67K, LY T67K, LW E67C LS E67B, LA E67B, LO E67B, LY E67B, LB E67C, LV E67C, LT E67C LW T67C LS T679, LY T679, LG T679 LS T770, LO T770, LY T770, LG T770, LP T770 LB T773, LV T773, LT T773, LW T773 LH T774 LS E675, LA E675, LY E675, LS T675 LS T776, LA T776, LO T776, LY T776, LB T776 LHGB T686 LT T68C, LB T68C - Hyper Mini TOPLED® LB M676 - Mini TOPLED Santana® LG M470 LS M47K, LO M47K, LY M47K Source: http://www.osram.convergy.de LUXEON: - LUMILED® LXK2-PW12-R00, LXK2-PW12-S00, LXK2-PW14-U00, LXK2-PW14-V00 LXK2-PM12-R00, LXK2-PM12-S00, LXK2-PM14-U00 LXK2-PE12-Q00, LXK2-PE12-R00, LXK2-PE12-S00, LXK2-PE14-T00, LXK2-PE14-U00 LXK2-PB12-K00, LXK2-PB12-L00, LXK2-PB12-M00, LXK2-PB14-N00, LXK2-PB14-P00, LXK2-PB14-Q00 LXK2-PR12-L00, LXK2-PR12-M00, LXK2-PR14-Q00, LXK2-PR14-R00 LXK2-PD12-Q00, LXK2-PD12-R00, LXK2-PD12-S00 LXK2-PH12-R00, LXK2-PH12-S00 LXK2-PL12-P00, LXK2-PL12-Q00, LXK2-PL12-R00 Source: www.luxeon.com KINGBRIGHT: KA-3528ASYC Source: www.kingbright.com
R1 R4-R8 R10 R11 R16-R23 R46 R47 = rcl:R-US_: RESISTOR, American symbol
R14 R15 R36 R37 = resistor:R-US_: RESISTOR, American symbol
R43 R44 = Passives:0402-JUMPER-3WAY: A 3-way solder jumper in 0402 size.
SW3 = CTS:218-2: CTS 218-2: 0.05" pitch DIP switch, SPST, 2 positions; PARTNO: 218-2LPST
U1 = Lepton_v5:OSCILLATOR
U$1-U$3 U$6 U$7 U$9 = Frames:CURRENT-C-LETTER-LANDSCAPE; BOM: EXCLUDE
U$8 = Lepton_v5:FLIR_LEPTON
U$11 = Logos:CURRENT-LOGO; BOM: EXCLUDE
U$12 = SparkFun:FT245RL: USB FIFO Controller 4th Generation USB Controller (USB <-> Parallel) - FIFO. Spark Fun Electronics SKU : COM-00787
U$17 = Lepton_v5:MIC5255: LDO, ceramic cap stable. available in 2.5-3.5 outputs
U$18 = Lepton_v5:MIC5268-1.2: ldo, ceramic cap stable, 1.2V 150mA
U$20 = Lepton_v5:LSF0108: 8 Channel Bidirectional Multi-Voltage Level Translator for Open-Drain and Push-Pull Applications.
X2 = TE:1734035-2: http://datasheet.octopart.com/1734035-2-TE-Connectivity-datasheet-11087025.pdf; PARTNO: 1734035-2
X3 = Molex:MICROFIT-06-DUAL: Molex MicroFit 3.00mm Pitch Header, Surface Mount, Dual Row, 6 Circuits Note, November 2014: These come in three styles: Through-hole, with metal clip retention to PCB (not currently represented) (cheapest) SMD, with solder tab retention (-SMD) (more expensive, commonly stocked) SMD, with metal clip retention (-SMD-CLIP_RETENTION) (most expensive, not often stocked) Please use them in that order! Drawing: http://www.molex.com/pdm_docs/sd/430450609_sd.pdf (right-angle) Information: http://www.molex.com/molex/products/datasheet.jsp?part=active/0430450618_PCB_HEADERS.xml; PARTNO: 43045-0609
X6 = TI:JTAG_HEADER: TI 14-pin JTAG header Reference: http://processors.wiki.ti.com/index.php/JTAG_Connectors; PARTNO: FTS-107-01-F-DV

## Net classes
1 power: width 0.406 mm

## Board
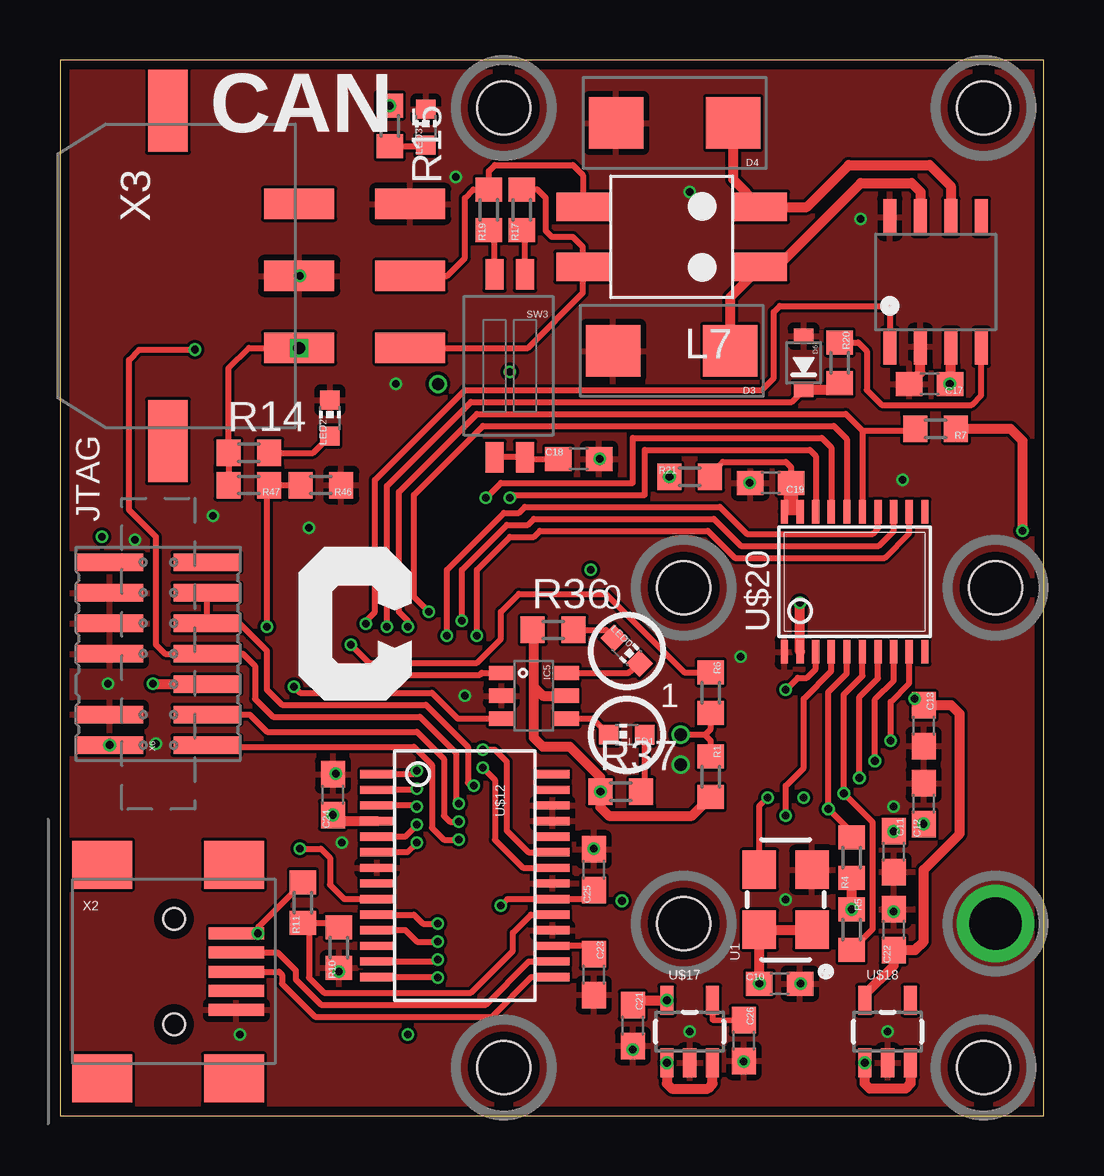
[diagram p6: board, top side]
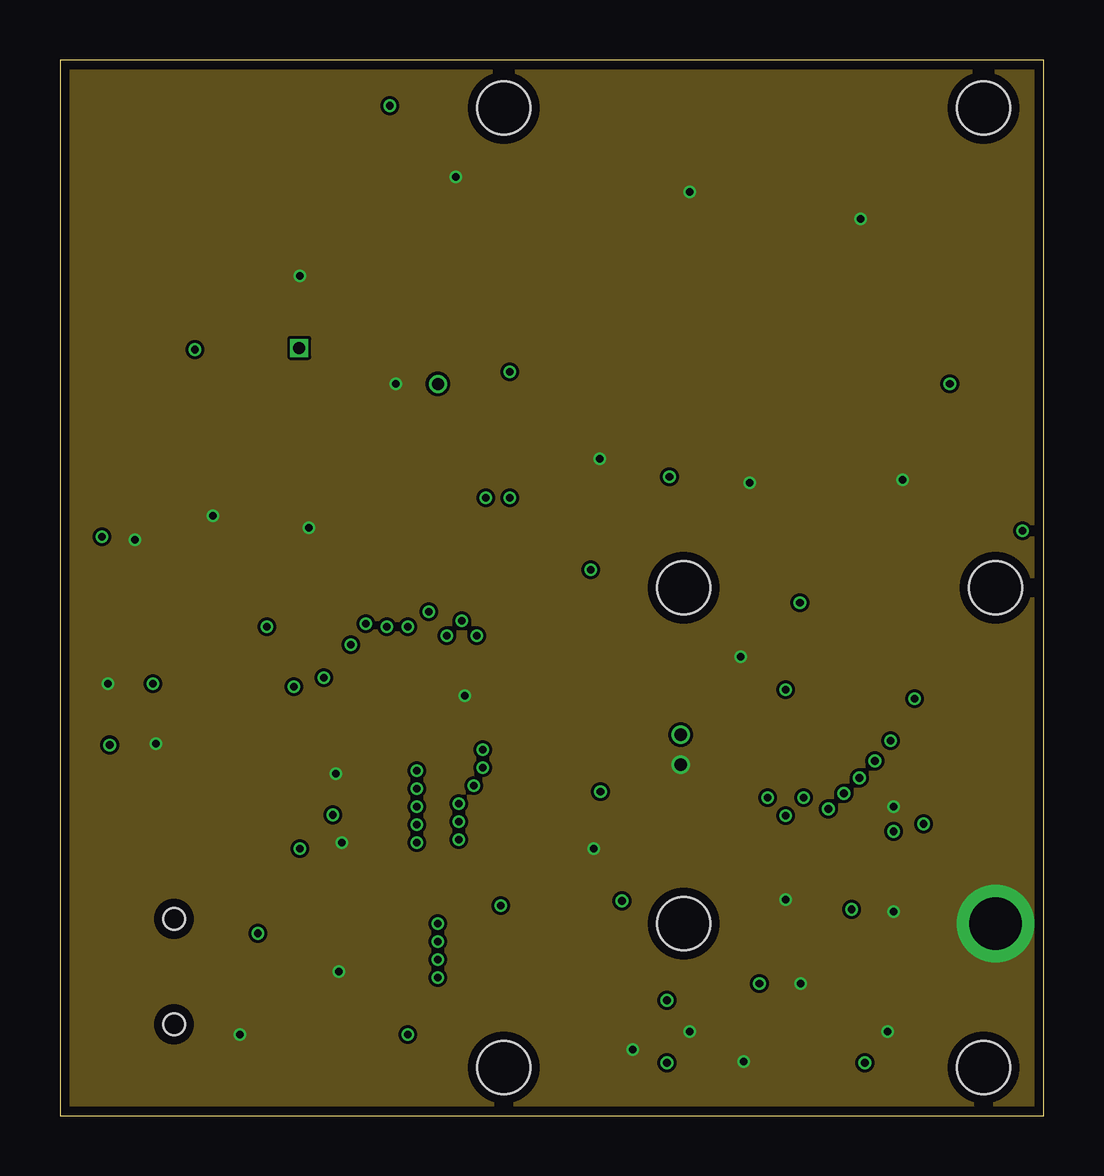
[diagram p7: board, inner layer GND]
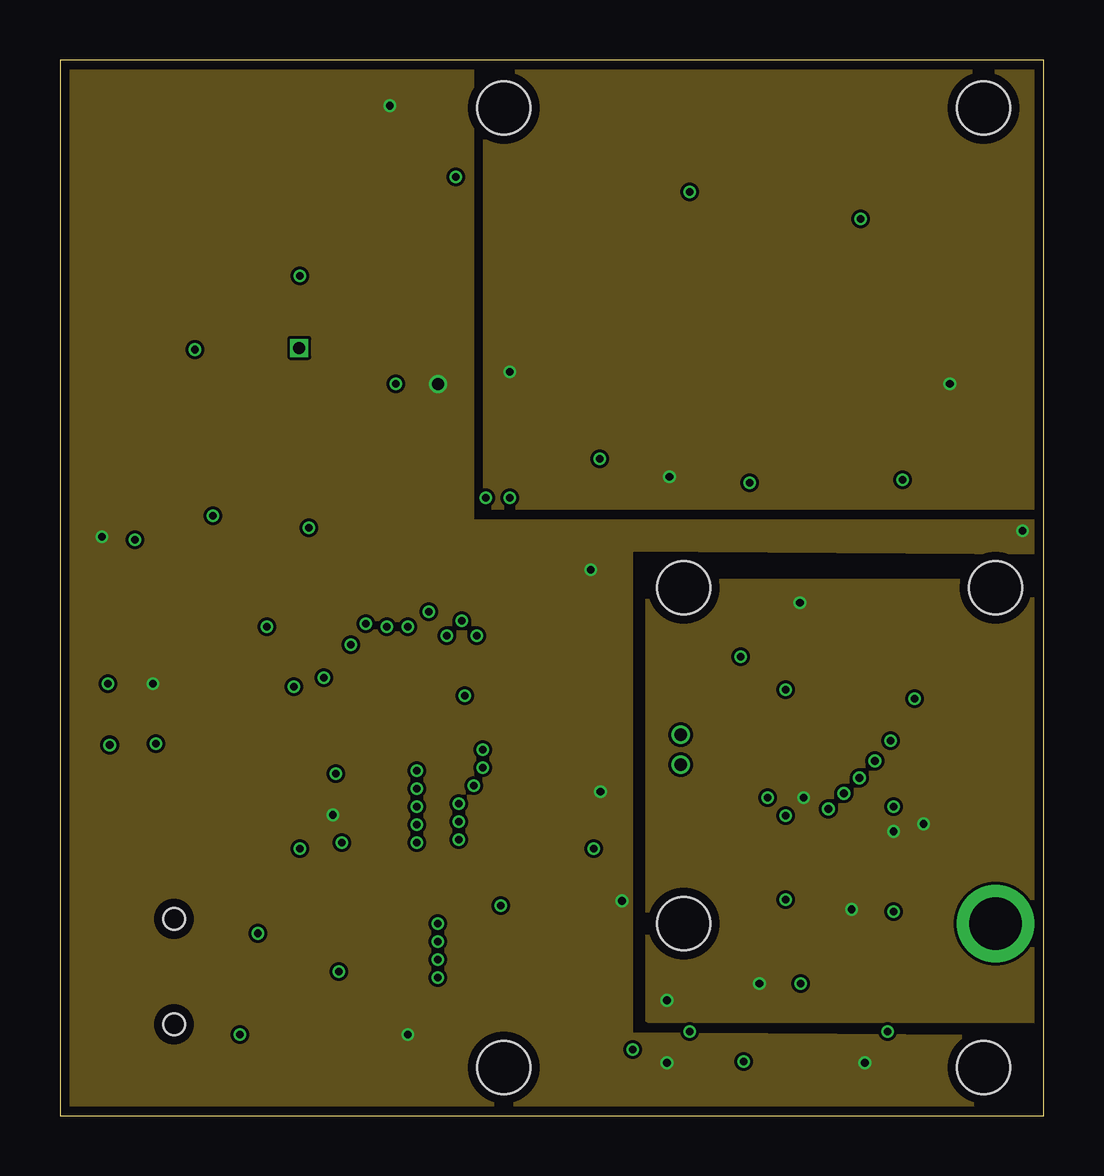
[diagram p8: board, inner layer PWR]
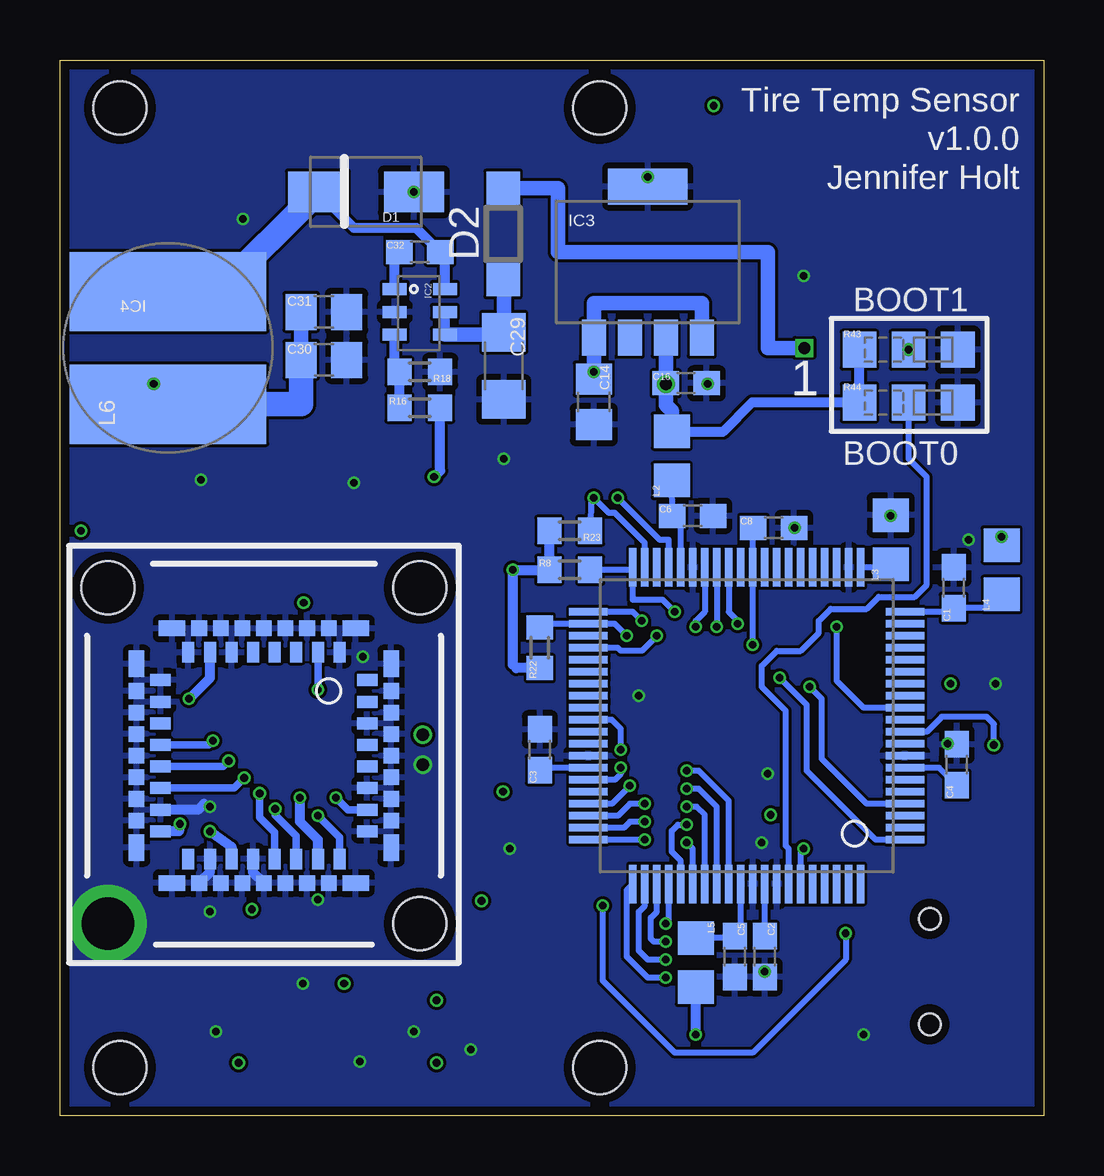
[diagram p9: board, bottom side, seen from below]

Size 41 x 44 mm. Coordinates in mm from the lower left corner, seen from the top.
Outline: 0,0 41,0 41,44 0,44 0,0
Copper layers (1+2*15+16): Top 0.0356mm / dielectric 0.1702mm / GND 0.0178mm / dielectric 1.1938mm / PWR 0.0178mm / dielectric 0.1981mm / Bottom 0.0356mm
Design rules "OSH Park 4-layer 5-5": minimum track width 5mil, minimum drill 10mil, track to track 5mil, track to pad 5mil, pad to pad 5mil, via to via 5mil, smd to smd 5mil, copper to edge 15mil, drill to drill 8mil, minimum pad ring 4mil, minimum via ring 4mil, stop-mask expansion 4mil, vias tented up to drill 20mil, thermal gap 10mil
Holes 2.2 mm at 18.5,42 18.5,2 38.5,2 38.5,42 26,22 26,8 39,22

### Footprints (pad centres in the part's own frame; a part is rotated, then mirrored left to right if it is on the bottom)
C0603 = smd 1.1 x 1: 1 -0.85,0; 2 0.85,0
C0805 = smd 1.3 x 1.5: 1 -0.95,0; 2 0.95,0
C1206 = smd 1.6 x 1.8: 1 -1.4,0; 2 1.4,0
SMA = smd 2.5 x 1.7: ANODE -2,0; CATHODE 2,0
SOD123 = smd 1.4 x 1.4: A 1.9,0; C -1.9,0
DO-214AA = smd 2.261 x 2.159: 1 -2.438,0; 2 2.438,0
SOD-323 = smd 0.63 x 0.83: ANODE -1.115,0; CATHODE 1.115,0
PQFP-80_(S-PQFP-G80) = smd 0.3 x 1.6: 1 -4.75,-6.6; 2 -4.25,-6.6; 3 -3.75,-6.6; 4 -3.25,-6.6; 5 -2.75,-6.6; 6 -2.25,-6.6; 7 -1.75,-6.6; 8 -1.25,-6.6; 9 -0.75,-6.6; 10 -0.25,-6.6; 11 0.25,-6.6; 12 0.75,-6.6; 13 1.25,-6.6; 14 1.75,-6.6; 15 2.25,-6.6; 16 2.75,-6.6; 17 3.25,-6.6; 18 3.75,-6.6; 19 4.25,-6.6; 20 4.75,-6.6; 41 4.75,6.6; 42 4.25,6.6; 43 3.75,6.6; 44 3.25,6.6; 45 2.75,6.6; 46 2.25,6.6; 47 1.75,6.6; 48 1.25,6.6; 49 0.75,6.6; 50 0.25,6.6; 51 -0.25,6.6; 52 -0.75,6.6; 53 -1.25,6.6; 54 -1.75,6.6; 55 -2.25,6.6; 56 -2.75,6.6; 57 -3.25,6.6; 58 -3.75,6.6; 59 -4.25,6.6; 60 -4.75,6.6 | smd 1.6 x 0.3: 21 6.6,-4.75; 22 6.6,-4.25; 23 6.6,-3.75; 24 6.6,-3.25; 25 6.6,-2.75; 26 6.6,-2.25; 27 6.6,-1.75; 28 6.6,-1.25; 29 6.6,-0.75; 30 6.6,-0.25; 31 6.6,0.25; 32 6.6,0.75; 33 6.6,1.25; 34 6.6,1.75; 35 6.6,2.25; 36 6.6,2.75; 37 6.6,3.25; 38 6.6,3.75; 39 6.6,4.25; 40 6.6,4.75; 61 -6.6,4.75; 62 -6.6,4.25; 63 -6.6,3.75; 64 -6.6,3.25; 65 -6.6,2.75; 66 -6.6,2.25; 67 -6.6,1.75; 68 -6.6,1.25; 69 -6.6,0.75; 70 -6.6,0.25; 71 -6.6,-0.25; 72 -6.6,-0.75; 73 -6.6,-1.25; 74 -6.6,-1.75; 75 -6.6,-2.25; 76 -6.6,-2.75; 77 -6.6,-3.25; 78 -6.6,-3.75; 79 -6.6,-4.25; 80 -6.6,-4.75
SOT-6_DDC = smd 0.5 x 1: 1 -0.95,-1.05; 2 0,-1.05; 3 0.95,-1.05; 4 0.95,1.05; 5 0,1.05; 6 -0.95,1.05
SOT-223-5 = smd 1 x 1.5: 1 -2.25,-3.15; 2 -0.75,-3.15; 3 0.75,-3.15; 4 2.25,-3.15 | smd 3.3 x 1.5: 5 0,3.15
D_(R-PDSO-G8) = smd 1.5 x 0.55: 1 -2.7,1.905; 2 -2.7,0.635; 3 -2.7,-0.635; 4 -2.7,-1.905; 5 2.7,-1.905; 6 2.7,-0.635; 7 2.7,0.635; 8 2.7,1.905
DBV_(R-PDSO-G6) = smd 0.6 x 1.05: 1 -0.95,-1.35; 2 0,-1.35; 3 0.95,-1.35; 4 0.95,1.35; 5 0,1.35; 6 -0.95,1.35
0603 = smd 1.4 x 1.5: A 1.025,0; B -1.025,0
VLP8040 = smd 3.3 x 8.2: 1 2.35,0; 2 -2.35,0
SMD = smd 2.21 x 1.2: 1 -3.7,1.25; 2 -3.7,-1.25; 3 3.7,-1.25; 4 3.7,1.25
CHIP-LED0603 = smd 0.8 x 0.8: A 0,-0.75; C 0,0.75
R0603 = smd 1 x 1.1: 1 -0.85,0; 2 0.85,0
0603-JUMPER-3WAY = smd 1.4 x 1.5: A 1.025,0; B -1.025,0; C 3.075,0
218-2_GULLWING = smd 0.76 x 1.27: 1A -0.635,-3.81; 1B -0.635,3.81; 2A 0.635,-3.81; 2B 0.635,3.81
CRYSTAL-OSC-SMD-5X3 = smd 1.6 x 1.4: 1 -1.25,-1.1; 2 1.25,-1.1; 3 1.25,1.1; 4 -1.25,1.1
105028-1001 = smd 0.5 x 0.84: 1 -3.15,-4.31; 2 -2.25,-4.31; 3 -1.35,-4.31; 4 -0.45,-4.31; 5 0.45,-4.31; 6 1.35,-4.31; 7 2.25,-4.31; 8 3.15,-4.31; 17 3.15,4.31; 18 2.25,4.31; 19 1.35,4.31; 20 0.45,4.31; 21 -0.45,4.31; 22 -1.35,4.31; 23 -2.25,4.31; 24 -3.15,4.31 | smd 0.84 x 0.5: 9 4.31,-3.15; 10 4.31,-2.25; 11 4.31,-1.35; 12 4.31,-0.45; 13 4.31,0.45; 14 4.31,1.35; 15 4.31,2.25; 16 4.31,3.15; 25 -4.31,3.15; 26 -4.31,2.25; 27 -4.31,1.35; 28 -4.31,0.45; 29 -4.31,-0.45; 30 -4.31,-1.35; 31 -4.31,-2.25; 32 -4.31,-3.15 | smd 1.1 x 0.65: M1 -3.83,-5.305; M9 3.83,-5.305; M19 3.83,5.305; M27 -3.83,5.305 | smd 0.65 x 0.65: M2 -2.7,-5.305; M3 -1.8,-5.305; M4 -0.9,-5.305; M5 0,-5.305; M6 0.9,-5.305; M7 1.8,-5.305; M8 2.7,-5.305; M11 5.305,-2.7; M12 5.305,-1.8; M13 5.305,-0.9; M14 5.305,0; M15 5.305,0.9; M16 5.305,1.8; M17 5.305,2.7; M20 2.7,5.305; M21 1.8,5.305; M22 0.9,5.305; M23 0,5.305; M24 -0.9,5.305; M25 -1.8,5.305; M26 -2.7,5.305; M29 -5.305,2.7; M30 -5.305,1.8; M31 -5.305,0.9; M32 -5.305,0; M33 -5.305,-0.9; M34 -5.305,-1.8; M35 -5.305,-2.7 | smd 0.65 x 1.1: M10 5.305,-3.83; M18 5.305,3.83; M28 -5.305,3.83; M36 -5.305,-3.83
SSOP28DB = smd 0.348 x 1.397: 1 -4.225,-3.656; 2 -3.575,-3.656; 3 -2.925,-3.656; 4 -2.275,-3.656; 5 -1.625,-3.656; 6 -0.975,-3.656; 7 -0.325,-3.656; 8 0.325,-3.656; 9 0.975,-3.656; 10 1.625,-3.656; 11 2.275,-3.656; 12 2.925,-3.656; 13 3.575,-3.656; 14 4.225,-3.656; 15 4.225,3.656; 16 3.575,3.656; 17 2.925,3.656; 18 2.275,3.656; 19 1.625,3.656; 20 0.975,3.656; 21 0.325,3.656; 22 -0.325,3.656; 23 -0.975,3.656; 24 -1.625,3.656; 25 -2.275,3.656; 26 -2.925,3.656; 27 -3.575,3.656; 28 -4.225,3.656
SOT23-5 = smd 0.55 x 1.2: 1 -0.95,-1.3; 2 0,-1.3; 3 0.95,-1.3; 4 0.95,1.3; 5 -0.95,1.3
TSSOP20 = smd 0.305 x 0.991: 1 -2.925,-2.918; 2 -2.275,-2.918; 3 -1.625,-2.918; 4 -0.975,-2.918; 5 -0.325,-2.918; 6 0.325,-2.918; 7 0.975,-2.918; 8 1.625,-2.918; 9 2.275,-2.918; 10 2.925,-2.918; 11 2.925,2.918; 12 2.275,2.918; 13 1.625,2.918; 14 0.975,2.918; 15 0.325,2.918; 16 -0.325,2.918; 17 -0.975,2.918; 18 -1.625,2.918; 19 -2.275,2.918; 20 -2.925,2.918
1734035-2 = smd 2.3 x 0.5: 1 2.6,1.6; 2 2.6,0.8; 3 2.6,0; 4 2.6,-0.8; 5 2.6,-1.6 | smd 2.5 x 2: P$1 -3,-4.45; P$2 -3,4.45; P$3 2.5,4.45; P$4 2.5,-4.45 | hole 0.9: 0,2.2; 0,-2.2
MICROFIT-6-DUAL-RA-SMD = smd 1.27 x 2.921: 1 3,5.47; 2 0,5.47; 3 -3,5.47; 4 3,10.1; 5 0,10.1; 6 -3,10.1 | smd 3.429 x 1.651: P$9 6.883,0; P$10 -6.883,0
TI_JTAG_HEADER_0.05"_SMT = smd 0.737 x 2.794: 1 -3.81,-2.032; 2 -3.81,2.032; 3 -2.54,-2.032; 4 -2.54,2.032; 5 -1.27,-2.032; 7 0,-2.032; 8 0,2.032; 9 1.27,-2.032; 10 1.27,2.032; 11 2.54,-2.032; 12 2.54,2.032; 13 3.81,-2.032; 14 3.81,2.032

### Placement (x,y rotation side)
C1  3.75,22 90 bottom
C2  11.62,6.62 270 bottom
C3  21,15.25 90 bottom
C4  3.62,14.62 90 bottom
C5  12.88,6.62 270 bottom
C6  14.62,25 0 bottom
C8  11.25,24.5 0 bottom
C10  30,5.5 0 top
C11  34.75,11 270 top
C12  36,13 90 top
C13  36,16.25 270 top
C14  18.75,29.75 270 bottom
C16  14.9,30.52 0 bottom
C17  36.25,30.5 180 top
C18  21.62,27.38 0 top
C19  29.62,26.38 180 top
C21  23.88,3.75 270 top
C22  34.75,7.75 90 top
C23  22.25,5.88 270 top
C24  11.38,13.38 90 top
C25  22.25,10.25 90 top
C26  28.5,3.12 270 top
C29  22.5,31.25 270 bottom
C30  30,31.5 0 bottom
C31  30,33.5 0 bottom
C32  26,36 0 bottom
D1  28.25,38.5 180 bottom
D2  22.52,36.75 90 bottom
D3  25.5,31.88 180 top
D4  25.62,41.38 180 top
D6  31,31.38 270 top
IC1  12.38,16.25 90 bottom
IC2  26,33.5 270 bottom
IC3  16.5,35.58 0 bottom
IC4  36.5,34.75 90 top
IC5  19.75,17.5 270 top
L2  15.5,27.5 90 bottom
L3  6.38,24 90 bottom
L4  1.75,22.75 90 bottom
L5  14.5,6.38 270 bottom
L6  36.5,32 90 bottom
L7  25.5,36.62 180 top
LED0  23.62,19.38 225 top
LED1  23.62,15.88 90 top
LED2  11.25,29.07 0 top
LED3  15.25,41.2 0 top
R1  27.12,14.12 270 top
R4  33,10.75 90 top
R5  33,7.75 270 top
R6  27.12,17.62 270 top
R7  36.5,28.62 180 top
R8  19.75,22.75 0 bottom
R10  11.62,7 90 top
R11  10.12,8.88 90 top
R14  7.88,27.62 0 top
R15  13.75,41.25 270 top
R16  26,29.5 0 bottom
R17  19.25,37.75 90 top
R18  26,31 180 bottom
R19  17.88,37.75 90 top
R20  32.5,31.38 270 top
R21  26.25,26.62 0 top
R22  21,19.5 90 bottom
R23  19.75,24.38 180 bottom
R36  20.56,20.24 0 top
R37  23.38,13.5 0 top
R43  6.65,31.93 0 bottom
R44  6.65,29.73 0 bottom
R46  10.88,26.27 180 top
R47  7.88,26.27 180 top
SW3  18.75,31.25 180 top
U1  30.25,9 90 top
U$1  0,0 0 top
U$2  0.5,0.5 0 top
U$3  41.31,44 135 top
U$6  24.22,49.42 180 top  (outside the outline)
U$7  0.03,-0.04 270 top
U$8  32.5,15 180 bottom
U$9  0,0 90 bottom
U$11  10,17.38 0 top
U$12  16.88,10 270 top
U$17  26.25,3.5 0 top
U$18  34.5,3.5 0 top
U$20  33.12,22.25 0 top
X2  4.75,6 0 top
X3  4.5,35 270 top
X6  4.1,19.25 90 top

### Tracks (layer width: path | path; a pad name or v marks a point on that pad's centre or on a via)
2.8V  (via drill 0.33)
  Top 0.406: U$17.5 24.05,4.8 C21.1 | C10.1 U1.4 U1.1 | U$20.2 v30.85,21.38 | R4.1 33.06,9.9 33,9.84 R5.1
  Bottom 0.406: U$8.23 30.25,11.5 31,12.25 v31,13.25 | U$8.16 36.05,11.85 C12.1 | U$8.19 33.85,11.2 C11.1
  other vias: 36,12.15 34.75,11.85 29.15,5.5 25.3,4.8 33,8.6
  pour PWR: 41,22.25 24.5,22.25 24.5,4 41,4
!CS  (via drill 0.33)
  Top 0.254: U$20.14 34.1,24.48 33.88,24.25 28.62,24.25 27.5,25.38 19.38,25.38 19.12,25.12 18.5,25.12 16.12,22.75 v16.12,20
  Bottom 0.254: IC1.44 17.75,19.5 17.62,19.38 16.75,19.38 v16.12,20
!CS!_A  (via drill 0.33)
  Top 0.254: U$20.7 34.1,18.23 33.33,17.45 v33.33,14.07
  Bottom 0.305: U$8.14 33.75,13.65 v33.33,14.07
!RESET  (via drill 0.33)
  Top 0.254: U$20.17 32.15,27.85 31.75,28.25 23.88,28.25 23.88,26.38 18.38,26.38 v17.75,25.75
  Bottom 0.254: IC1.37 15.62,24 16,24 v17.75,25.75
!RESET!_A  (via drill 0.33)
  Top 0.254: v30.25,12.5 30.25,13.75 31,14.5 31,17.38 32.15,18.52 U$20.4
  Bottom 0.305: U$8.24 29.35,11.6 v30.25,12.5
!TRST  (via drill 0.33)
  Bottom 0.254: IC1.10 4.88,16 4.25,16.62 2.38,16.62 2.07,16.32 X6.2
  other vias: 2.07,15.44
+1V2  (via drill 0.33)
  Top 0.406: v35.62,17.38 35.9,17.1 C13.1 37.15,17.1 37.5,16.75 37.5,11.75 36,10.25 36,7.25 35.65,6.9 C22.1 34.75,6.25 33.55,5.05 U$18.5
  Bottom 0.406: U$8.7 34.75,18.25 v35.62,17.38
+3V3  (via drill 0.33, 0.5)
  Top 0.406: U$17.3 27.2,1.32 27,1.12 25.5,1.12 25.3,1.32 U$17.1 | U$18.3 35.45,1.32 35.25,1.12 33.75,1.12 33.55,1.32 U$18.1 | U$12.4 11.62,12.28 C24.1 | 19.75,17.88 19.75,15.75 20.12,15.38 21.25,15.38 22.52,14.1 R37.1 22.52,12.85 22.88,12.5 26.35,12.5 R1.2 | IC5.5 20.12,17.5 19.75,17.88 | 19.75,17.88 19.75,19.95 R36.1 | v3.88,18 3.9,17.98 X6.5 | R7.1 39.62,28.62 40.12,28.12 v40.12,24.38
  Bottom 0.254: 15.47,28.5 L2.A
  Bottom 0.406: L4.A v1.75,24.12 | R43.B R44.B 12.15,29.73 13.38,28.5 15.47,28.5 | v14.5,3.38 L5.A | R22.1 21.98,18.65 22.12,18.8 v22.12,22.75 R8.1 R23.2
  Bottom 0.61: IC3.3 C16.1 v15.75,30.5 15.75,29.62 15.5,29.38 L2.A
  other vias: 25.3,2.2 33.55,2.2 11.38,12.53 13.75,42.1 22.52,13.5 23.43,8.95
  pour PWR: 0,44 17.12,44 17.12,24.75 41,24.75 41,23.5 23.75,23.62 23.75,3.38 41,3.25 41,0 0,0
+5V  (via drill 0.33)
  Top 0.406: IC4.3 37.13,31.02 C17.1
  Bottom 0.406: R16.2 25.15,26.88 R21.1 | 36.5,30.5 C17.1
  Bottom 0.61: IC3.4 14.25,33.88 18.75,33.88 IC3.1 v18.75,31 C14.1 | C30.1 C31.1 | L6.2 36.5,30.5
  Bottom 1.016: C30.1 30.95,29.65 L6.2
  other vias: 25.4,26.62 37.1,30.5
  pour PWR: 41,25.38 17.75,25.38 17.75,32.12 17.75,33.25 17.75,43.88 41,44
+12V  (via drill 0.5)
  Top 0.254: X3.1 7.88,32 7.03,31.15 R14.1 R47.2
  Bottom 0.61: D2.A 20.25,38.65 20.25,36 11.5,36 11.5,32 X3.1
  other vias: 9.97,32
CAN-RX  (via drill 0.33)
  Top 0.254: D6.CATHODE 30.5,29.75 17.12,29.75 13.62,26.25 v13.62,20.38
  Top 0.406: D6.CATHODE 32.23,30.26 R20.2
  Bottom 0.254: IC1.33 v13.62,20.38
CAN-TX  (via drill 0.33)
  Top 0.254: v12.75,20.5 12.75,20.62 13.12,21 13.12,26.5 16.88,30.25 29.25,30.25 29.75,30.75 29.75,33.5 30,33.75 34.5,33.75 34.59,33.66 IC4.1
  Bottom 0.254: IC1.32 13.12,21 12.75,20.62 v12.75,20.5
CANH
  Top 0.254: R17.2 19.9,38.6 20.25,38.25 20.25,36.88 20.5,36.62 21.38,36.62 21.8,36.2 L7.4 21.8,34.3 19.5,32 X3.4
CANL
  Top 0.254: L7.3 21.8,39.2 21.38,39.62 18.12,39.62 17.88,39.38 R19.2 17.23,38.6 16.88,38.25 16.88,35.75 16.12,35 X3.5
CLK  (via drill 0.33)
  Top 0.254: U$20.13 34.75,24.38 34.12,23.75 28.38,23.75 27.25,24.88 19.75,24.88 19.5,24.62 18.62,24.62 16.75,22.75 v16.75,20.62
  Bottom 0.254: IC1.41 17.12,21 v16.75,20.62
CLK_A  (via drill 0.33)
  Top 0.254: U$20.8 34.75,18.12 33.98,17.35 v33.98,14.78
  Bottom 0.305: U$8.13 34.2,14.55 v33.98,14.78
D0  (via drill 0.33)
  Top 0.254: U$12.1 14.72,14.22 v14.88,14.38
  Bottom 0.254: IC1.69 13.12,13.12 14.38,14.38 v14.88,14.38
D1  (via drill 0.33)
  Top 0.254: U$12.5 14.38,11.62 v14.88,12.12
  Bottom 0.254: IC1.65 15.12,10.62 15.5,11 15.5,11.88 15.25,12.12 v14.88,12.12
D2  (via drill 0.33)
  Top 0.254: U$12.3 14.82,12.93 v14.88,12.88
  Bottom 0.254: IC1.67 14.12,12.55 14.45,12.88 v14.88,12.88
D3  (via drill 0.33)
  Top 0.254: U$12.11 14.4,7.72 14.88,7.25 v15.75,7.25
  Bottom 0.254: IC1.63 16.12,8.5 16.38,8.25 16.38,7.38 16.25,7.25 v15.75,7.25
D4  (via drill 0.33)
  Top 0.254: U$12.2 14.82,13.57 v14.88,13.62
  Bottom 0.254: IC1.68 13.62,12.88 14.38,13.62 v14.88,13.62
D5  (via drill 0.33)
  Top 0.254: U$12.9 11.85,9.03 11.25,9.62 11.25,10.75 10.88,11.12 v10,11.12
  Bottom 0.254: IC1.75 10.12,11 v10,11.12
D6  (via drill 0.33)
  Top 0.254: U$12.10 14.75,8.38 15.12,8 v15.75,8
  Bottom 0.254: IC1.64 15.62,8.12 v15.75,8
D7  (via drill 0.33)
  Top 0.254: U$12.6 14.47,10.97 v14.88,11.38
  Bottom 0.254: IC1.66 14.62,11.12 v14.88,11.38
FSYNC  (via drill 0.33)
  Top 0.254: U$20.18 31.5,27.5 31.25,27.75 24.38,27.75 24.38,25.88 18.88,25.88 v18.75,25.75
  Bottom 0.254: IC1.39 16.62,23.88 17.88,25.12 18.12,25.12 v18.75,25.75 18.85,25.85 R23.1
FSYNC_A  (via drill 0.33)
  Top 0.254: v30.25,17.75 30.75,18.25 31.12,18.25 31.5,18.62 U$20.3
  Bottom 0.305: v30.25,17.75 U$8.2
GND  (via drill 0.33, 0.51, 2.2)
  Top 0.406: IC4.2 35.87,30.96 C17.2
  Bottom 0.406: U$8.15 35.25,12.75 35,13 | U$8.20 32.95,10.14 U$8.M23 | U$8.18 C11.2 U$8.M20
  other vias: 26.25,3.5 34.5,3.5 34.75,12.88 30.25,9 30.88,5.5 23.88,2.75 28.38,19.12 28.5,2.25 7.5,3.38 2,18 22.25,11.12 25.88,14.62 39,8 28.75,26.38 22.5,27.38 14,30.5 11.62,6 4,15.5 10.38,24.5 6.38,25 10,35 33.38,37.38 26.25,38.5 35.12,26.5 16.88,17.5 11.75,11.38 34.75,8.5 16.5,39.12 3.12,24 11.5,14.25
  pour Bottom: 0,44 41,44 41,0 0,0
  pour Top (rank 5): 0,44 41,44 41,0 0,0
  pour GND: 0,44 41,44 41,0 0,0
GPIO34
  Bottom 0.254: IC1.74 10.62,11.12 10.75,11.25 10.75,16.88 11.75,17.88 11.75,18.75 11.12,19.38 10.12,19.38 9.38,20.12 9.38,20.62 8.88,21.12 7.38,21.12 6.88,21.62 5.38,21.62 4.88,22.12 4.88,26.62 5.62,27.38 R44.A
LED0  (via drill 0.33)
  Top 0.254: IC5.1 17.57,18.45 17.5,18.38 11.12,18.38 v11,18.25
  Bottom 0.254: IC1.1 7,11.5 9.88,14.38 9.88,17.12 v11,18.25
LED1  (via drill 0.33)
  Top 0.254: IC5.3 16.57,16.55 15.5,17.62 10,17.62 v9.75,17.88
  Bottom 0.254: IC1.4 7.38,13 9.25,14.88 9.25,17.38 v9.75,17.88
MCLK  (via drill 0.33)
  Top 0.254: U1.3 29.15,12.9 v29.5,13.25
  Bottom 0.305: U$8.26 29,12.75 v29.5,13.25
MISO  (via drill 0.33)
  Top 0.254: U$20.12 35.4,24.27 34.38,23.25 28.12,23.25 27,24.38 20,24.38 19.75,24.12 18.75,24.12 17.38,22.75 v17.38,20
  Bottom 0.254: v17.38,20 17.88,20.5 IC1.42 20.85,20.5 R22.2
MISO_A  (via drill 0.33)
  Top 0.254: U$20.9 35.4,18.02 34.62,17.25 v34.62,15.62
  Bottom 0.305: U$8.12 34.8,15.45 v34.62,15.62
N$1
  Top 0.254: R14.2 10.55,27.62 LED2.A
N$2
  Top 0.254: R15.2 15.2,40.4 LED3.A
N$3
  Bottom 0.406: IC2.6 24.95,35.8 C32.2 26.15,37 28.75,37 D1.CATHODE
  Bottom 1.016: L6.1 34.4,34.35 D1.CATHODE
N$4
  Top 0.254: R21.2 27.1,26.73 27.62,27.25 30.25,27.25 30.48,27.02 C19.1
  Top 0.305: U$20.19 U$20.20 30.48,25.44
  Top 0.61: C19.1 30.48,25.44
N$5  (via drill 0.33)
  Top 0.254: C25.1 22.25,9.03 U$12.20 18.65,9.03 v18.38,8.75 | 8,7.6 8,7.62 v8.25,7.59 8.28,7.88 R11.2
  Top 0.406: X2.1 v8.25,7.6 v8.25,7.59
  Bottom 0.254: v18.38,8.75 18.38,5.62 15.38,2.62 12.12,2.62 8.25,6.5 v8.25,7.59
N$6
  Top 0.254: R10.2 11.45,8.03 R11.1 10.38,7.78 10.38,5.75 11,5.12 17.12,5.12 18.88,6.88 18.88,7.62 19.62,8.38 U$12.19
N$7
  Bottom 0.406: IC2.1 27.05,35.8 C32.1
N$8
  Bottom 0.406: IC2.4 IC2.5 | C29.1 22.6,32.55 | 22.5,34.7 D2.C
  Bottom 0.61: 22.6,32.55 IC2.4 | C29.1 22.5,34.7
N$10
  Bottom 0.254: IC1.21 6,22.85 L3.B
N$11
  Bottom 0.254: IC1.36 15.12,24.65 C6.1 L2.B
N$12
  Bottom 0.254: IC1.70 12.62,7.72 C5.1 12.95,7.4 L5.B
N$20
  Top 0.406: D4.1 28.06,39.01 L7.2 31.12,37.88 32.88,39.62 36.25,39.62 37.13,38.74 IC4.6
N$21
  Top 0.406: D3.1 27.94,34.11 L7.1 29.88,35.38 33.38,38.88 35.5,38.88 35.87,38.51 IC4.7
N$22
  Top 0.254: SW3.2A 18.11,36.66 R19.1
N$23
  Top 0.254: SW3.1A 19.39,36.78 R17.1
N$24
  Top 0.254: 18.12,27.45 SW3.2B SW3.1B 19.45,27.38 C18.1
N$25
  Top 0.254: U$12.15 19.65,5.78 18,4.12 10.62,4.12 9.25,5.5 9.25,5.88 9.12,6 X2.3
N$27
  Top 0.254: U$12.16 19.55,6.42 17.75,4.62 10.88,4.62 9.82,5.67 9.82,6.05 9.07,6.8 X2.2
N$30
  Top 0.254: U$12.17 22.25,7.08 C23.1
N$31
  Top 0.254: C26.1 27.2,4 U$17.4
N$32
  Top 0.254: IC4.4 38.41,30.03 38,29.62 34.25,29.62 33.62,30.25 33.62,31.88 33.27,32.23 R20.1
  Top 0.406: R20.1 32.52,32.23 32.7,32.05
N$37
  Top 0.254: IC5.6 23.7,18.45 LED0.C
N$38
  Top 0.254: IC5.4 22.2,16.55 LED1.C
N$39
  Top 0.254: R36.2 21.63,20.24 22.75,20.25 LED0.A
N$40
  Top 0.254: LED1.A 24.38,13.72 R37.2
PWROUT_INT  (via drill 0.33)
  Top 0.254: R46.2 R47.1 8.72,26.1 8.62,26 v8.62,20.38
  Bottom 0.254: IC1.12 7.5,17 8.62,18.12 v8.62,20.38
RD  (via drill 0.33)
  Top 0.254: U$12.13 15.68,6.42 v15.75,6.5
  Bottom 0.254: IC1.62 16.62,8.75 16.88,8.5 16.88,6.88 16.5,6.5 v15.75,6.5
RXF  (via drill 0.33)
  Top 0.254: U$12.23 19.52,10.97 18.62,11.88 18.62,14.75 18.12,15.25 v17.62,15.25
  Bottom 0.254: IC1.50 18,16.5 17.62,16.12 v17.62,15.25
SCL  (via drill 0.33)
  Top 0.254: 33.45,28.55 U$20.15 | 33.45,28.55 32.75,29.25 17.38,29.25 14.12,26 14.12,21 14.5,20.62 v14.5,20.38 | 33.45,28.55 35.58,28.55 R7.2
  Bottom 0.254: IC1.34 14.12,21 14.5,20.62 v14.5,20.38
SCL_A  (via drill 0.33)
  Top 0.254: U$20.6 33.45,18.32 32.67,17.55 v32.67,13.43 33.88,12.22 33.88,7.78 R5.2
  Bottom 0.305: U$8.21 32.05,11.8 32.67,12.43 v32.67,13.43
SDA  (via drill 0.33)
  Top 0.254: U$20.16 32.8,28.2 32.25,28.75 17.62,28.75 14.75,25.88 14.75,21.62 v15.38,21
  Bottom 0.254: v15.38,21 15.88,21.5 17.12,21.5 IC1.40 17.23,22.75 R8.2
SDA_A  (via drill 0.33)
  Top 0.254: 33,11.8 v32.02,12.78 32.02,17.65 32.8,18.43 U$20.5
  Top 0.305: R4.2 33,11.8
  Bottom 0.305: v32.02,12.78 32.02,12.53 31.15,11.65 U$8.22
TCK  (via drill 0.33)
  Top 0.254: X6.11 X6.9 7.48,20.52 8.62,19.38 8.62,17.75 9.25,17.12 15.25,17.12 17,15.38 17,13.88 17.12,13.75 v17.25,13.75
  Bottom 0.254: IC1.57 18,13 v17.25,13.75
TDI  (via drill 0.33)
  Top 0.254: v16.62,12.25 16.25,12.25 16,12.5 16,14.88 14.88,16 8.62,16 7.92,16.71 X6.3
  Bottom 0.254: IC1.59 17.5,12 17.25,12.25 v16.62,12.25
TDO  (via drill 0.33)
  Top 0.254: v16.62,13 16.5,13.12 16.5,15.12 15,16.62 8.88,16.62 8.12,17.38 8.12,18.75 7.62,19.25 X6.7 4.38,19.25 4,19.62 4,24.12 2.88,25.25 2.88,31.5 3.3,31.93 R43.A
  Bottom 0.254: IC1.58 17.75,12.5 17.25,13 v16.62,13
  other vias: 5.62,31.93
TEMP_INPUT  (via drill 0.51)
  Top 0.254: 26.88,15.88 v25.88,15.88 | 26.88,15.88 27.12,16.12 R6.2 | 26.88,15.88 27.12,15.62 R1.1
TEMP_SENSE  (via drill 0.33)
  Top 0.254: v12.12,19.62 12.88,18.88 17.38,18.88 18.38,19.88 18.38,21 19.12,21.75 22.75,21.75 26.02,18.48 R6.1
  Bottom 0.254: v12.12,19.62 IC1.30 12.12,24.48 C8.1
TMS  (via drill 0.33)
  Top 0.254: v16.62,11.5 16,11.5 15.5,12 15.5,14.62 14.75,15.38 6.2,15.38 X6.1
  Bottom 0.254: v16.62,11.5 IC1.60
TXE  (via drill 0.33)
  Top 0.254: U$12.22 19.3,10.32 18.12,11.5 18.12,14 v17.62,14.5
  Bottom 0.254: IC1.55 17.88,14 17.62,14.25 v17.62,14.5
VDD1
  Bottom 0.254: C2.1 IC1.72
VDD2
  Bottom 0.254: IC1.54 20.9,14.5 C3.1
VDD3
  Bottom 0.254: IC1.7 4.35,14.5 C4.1
VDDA
  Bottom 0.254: IC1.20 3.9,21 C1.1 1.82,21.15 L4.B
VSENSE1
  Bottom 0.406: R16.1 R18.2 27.05,31.2 IC2.3
WR  (via drill 0.33)
  Top 0.254: U$12.14 15.72,5.78 v15.75,5.75
  Bottom 0.254: v15.75,5.75 16.5,5.75 17.38,6.62 17.38,9.4 IC1.61

### Text on the board
tPlace: CAN | JTAG | 0 | 1
bPlace: Tire Temp Sensor | v1.0.0 | Jennifer Holt | BOOT1 | 1 | BOOT0